# EasyEDA Pro project gdRelay.eprj

# Schematic Schematic1
Board Name: Rx; Create Date: 2024-09-17
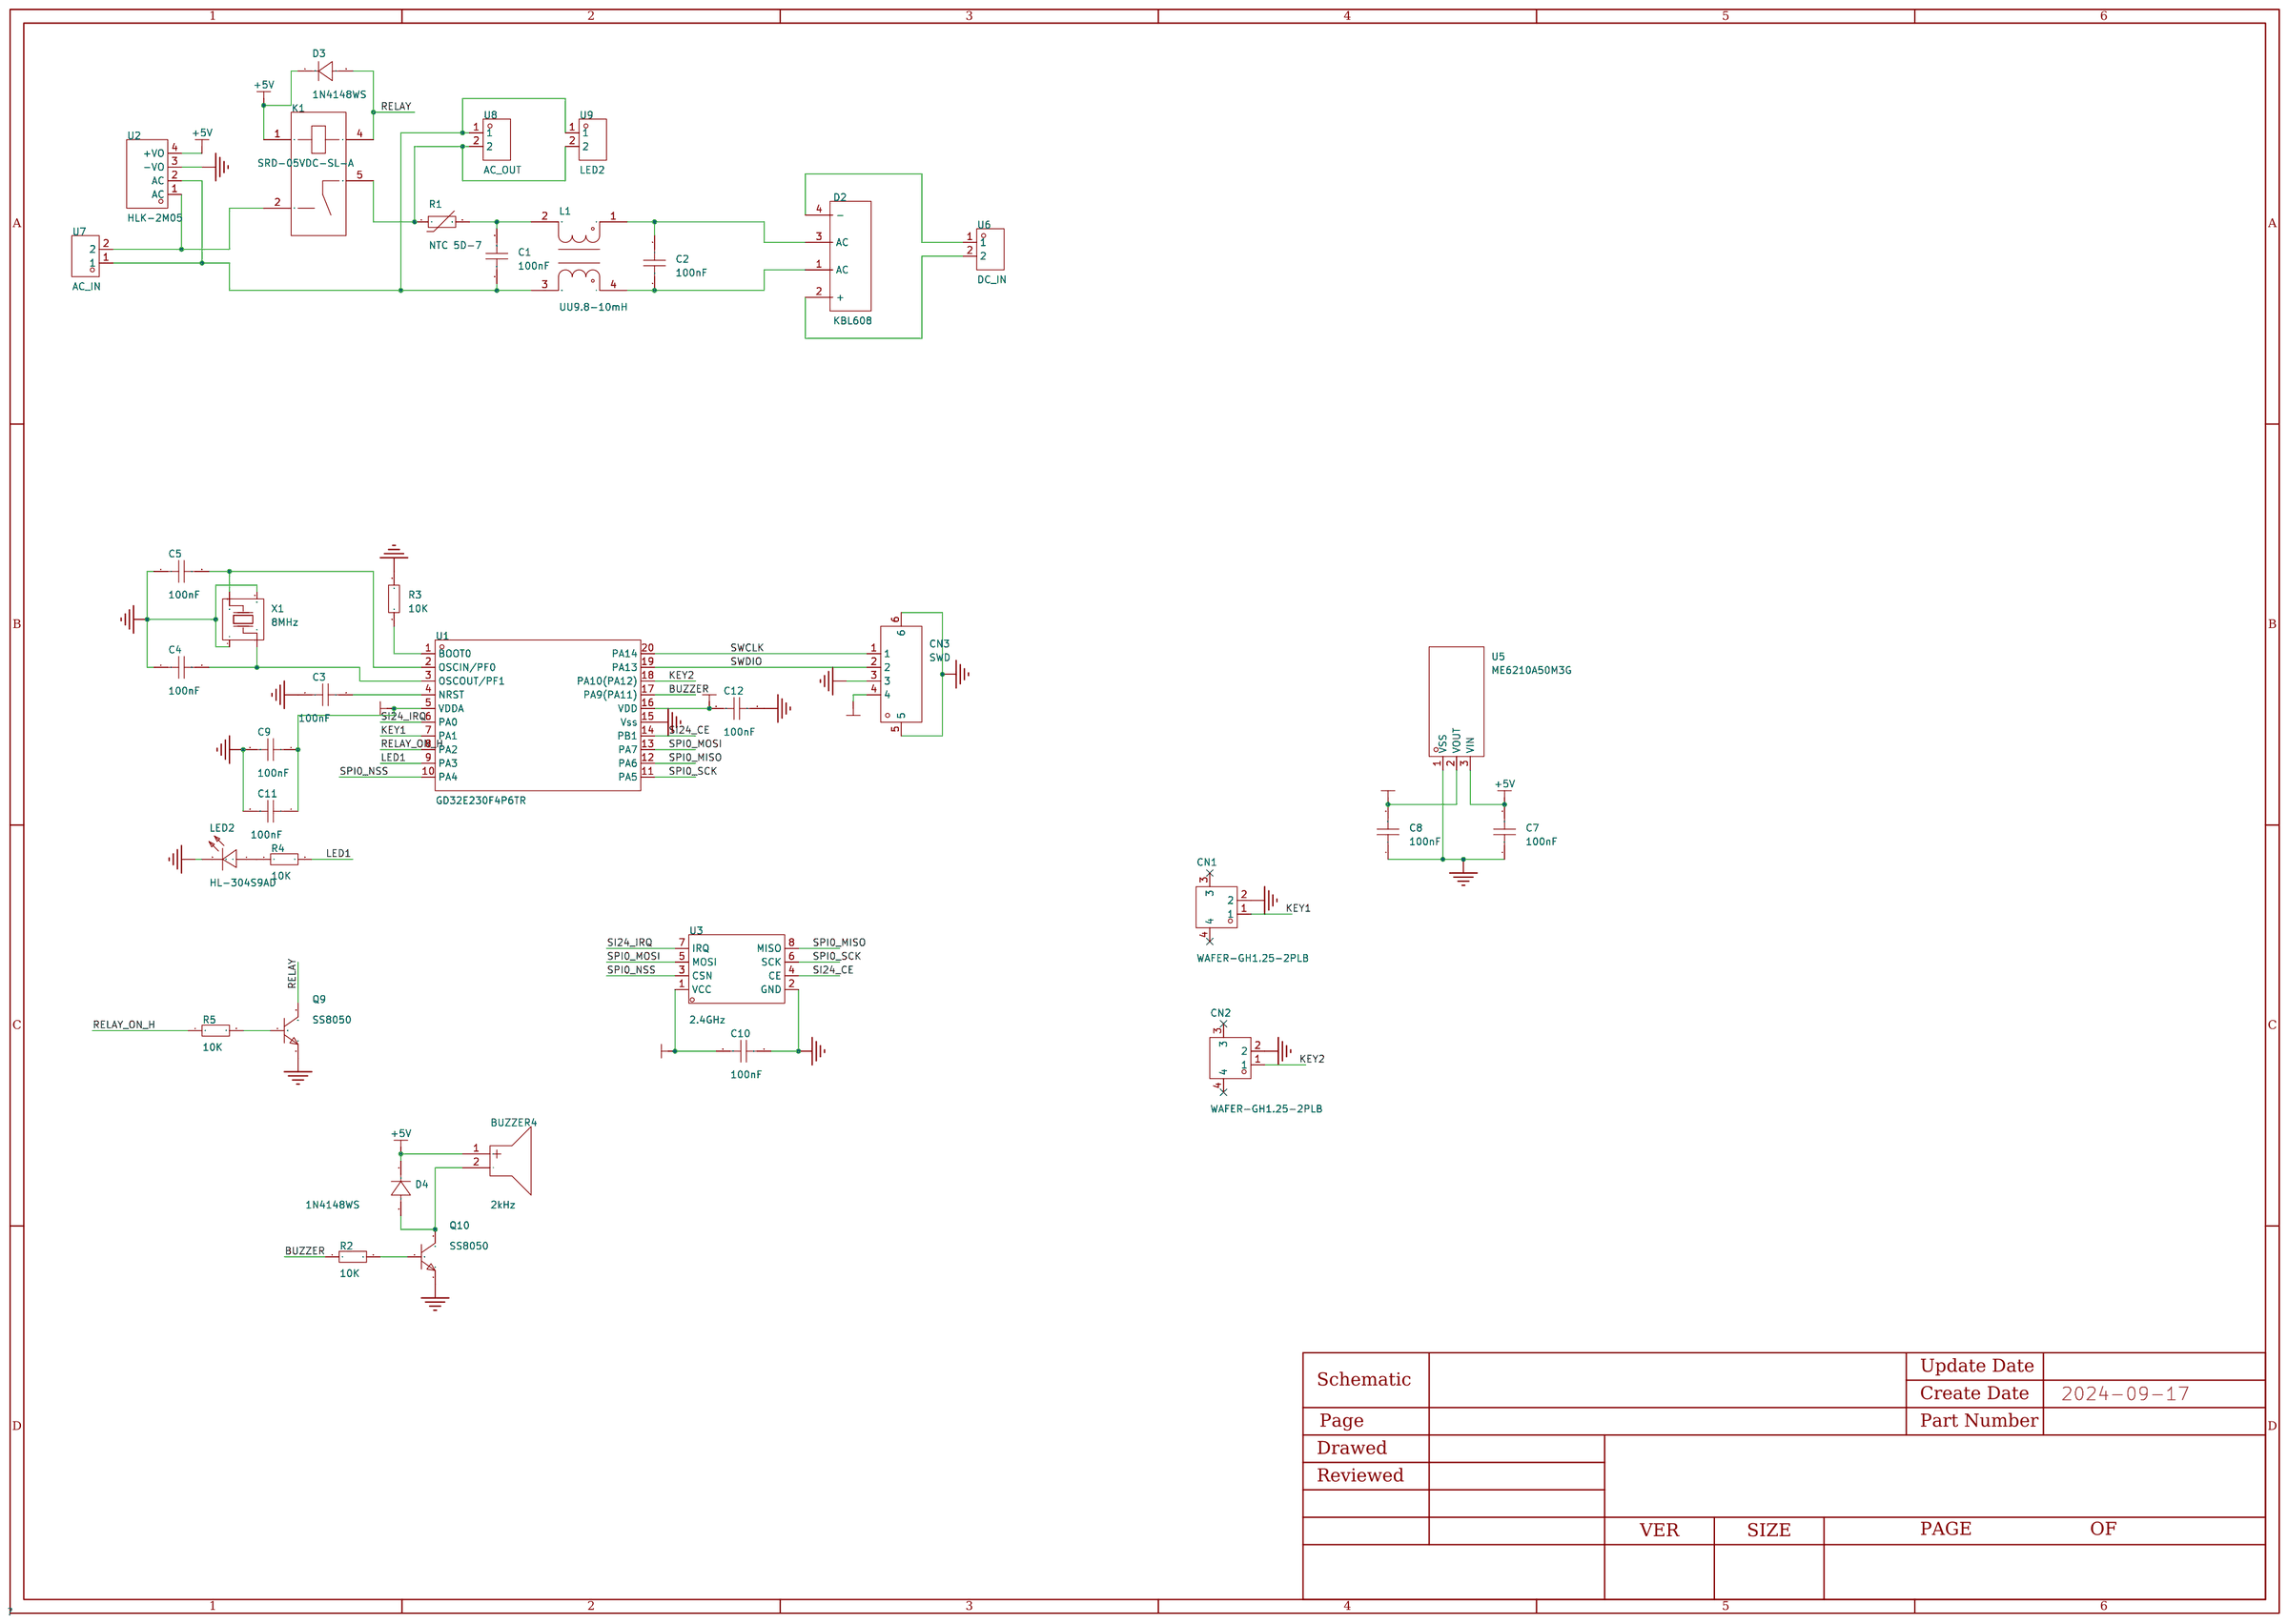
[diagram p0: schematic sheet]

## Parts
BUZZER4  2kHz  [BUZ-SMD_2P-L12.0-W12.0-L]
C1  100nF  [CAP-TH_L13.0-W6.0-P10.0-D0.6]
C2  100nF  [CAP-TH_L13.0-W6.0-P10.0-D0.6]
C3  100nF  [C0603]
C4  100nF  [C0603]
C5  100nF  [C0603]
C7  100nF  [C0603]
C8  100nF  [C0603]
C9  100nF  [C0603]
C10  100nF  [C0603]
C11  100nF  [C0603]
C12  100nF  [C0603]
CN1  WAFER-GH1.25-2PLB  [CONN-TH_2P-P1.25_XUNPU_WAFER-GH1.25-2PLB]
CN2  WAFER-GH1.25-2PLB  [CONN-TH_2P-P1.25_XUNPU_WAFER-GH1.25-2PLB]
CN3  SWD  [CONN-SMD_4P-P1.27_GH125-S04DCA-00]
D2  KBL608  [DIO-BG-TH_KBL608]
D3  1N4148WS  [SOD-323_L1.8-W1.3-LS2.5-RD]
D4  1N4148WS  [SOD-323_L1.8-W1.3-LS2.5-RD]
K1  SRD-05VDC-SL-A  [RELAY-TH_SRD-DCXXV-SL-A]
L1  UU9.8-10mH  [FILTER-TH_4P-L17.0-W12.0-P7.00-D0.6-S8.00]
LED2  HL-304S9AD  [LED-TH_BD3.0-P2.54-FD]
Q9  SS8050  [SOT-23-3_L2.9-W1.3-P1.90-LS2.4-BR]
Q10  SS8050  [SOT-23-3_L2.9-W1.3-P1.90-LS2.4-BR]
R1  NTC 5D-7  [RES-TH_L8.5-W5.5-P5.00-D0.6-S5.50]
R2  10K  [R0603]
R3  10K  [R0603]
R4  10K  [R0603]
R5  10K  [R0603]
U1  GD32E230F4P6TR  [TSSOP-20_L6.5-W4.4-P0.65-LS6.4-BL]
U2  HLK-2M05  [PWRM-TH_HLK-2M05]
U3  2.4GHz  [WIRELM-TH_NF-01-S]
U5  ME6210A50M3G  [SOT-23-3_L2.9-W1.6-P1.90-LS2.8-BR]
U6  DC_IN  [CONN-TH_VH3.96-3A2]
U7  AC_IN  [CONN-TH_VH3.96-3A2]
U8  AC_OUT  [CONN-TH_VH3.96-3A2]
U9  LED2  [CONN-TH_VH3.96-3A2]
X1  8MHz  [OSC-SMD_4P-L3.2-W2.5-BL]

## Library data of the parts
BUZZER4 = PKLCS1212E2000-R1: LCSC Part Name: 压电蜂鸣器 2kHz 12.0*12.0*3.0 mm; Supplier Part: C184513; Manufacturer: muRata(村田); JLCPCB Part Class: 扩展库; Datasheet: https://atta.szlcsc.com/upload/public/pdf/source/20200305/C492053_735FBBD713E87D0F645D81009B709975.pdf; Supplier: LCSC; Oscillator Circuit: 无源(外部驱动); Technology Type: 压电式; Operating Voltage: -12.5V~12.5V; Sound Pressure Level (SPL): 76dB@1.5V,10cm; Length: 12mm; Width: 12mm; Height: 3mm; Operating Temperature: -20℃~+70℃
C1 C2 = MKP62-275V104KP10: LCSC Part Name: 100nF ±10% 275V; Supplier Part: C2888214; Manufacturer: 东通电子; Supplier Footprint: 插件,P=10mm; JLCPCB Part Class: 扩展库; Datasheet: https://atta.szlcsc.com/upload/public/pdf/source/20210917/C2888214_A5EBC9FD7D7E3E6A075EFE493DE417E1.pdf; Supplier: LCSC; Tolerance: ±10%; Voltage(AC): 275V
C3-C5 C7-C12 = CAP_0603: Supplier Footprint: 0603
CN1 CN2 = WAFER-GH1.25-2PLB: LCSC Part Name: 1x2P 间距:1.25mm 立贴 系列:GH; Supplier Part: C3029368; Manufacturer: XUNPU(讯普); Supplier Footprint: SMD,P=1.25mm; JLCPCB Part Class: 扩展库; Datasheet: https://atta.szlcsc.com/upload/public/pdf/source/20220527/44F824AAC8C2B617205E15955FF9C23D.pdf; Supplier: LCSC; Pins Structure: 1x2P; Pitch: 1.25mm; Mounting Style: 立贴; Reference Series: GH; Number of Pins: 2P; Number of Rows: 1; Number of PINs Per Row: 2; Current Rating (Max): 1A; Operating Temperature Range: -25℃~+85℃
CN3 = GH125-S04DCA-00: 参考系列:-;间距:1.25mm;插针结构:1x4P;排数:1;每排PIN数:4;行距:-;公母:公型插针;安装方式:卧贴;额定电流:1A;工作温度范围:-25℃~+85℃;; LCSC Part Name: GH1.25卧式贴片 带扣; Supplier Part: C2886767; Manufacturer: JS(钜硕电子); Supplier Footprint: SMD,P=1.25mm; JLCPCB Part Class: Extended Part; Datasheet: https://atta.szlcsc.com/upload/public/pdf/source/20210818/CD11791E5ED3EDF45A7009E9C8A2BD4C.pdf; Supplier: LCSC; Pitch: 1.25mm; Pins Structure: 1x4P; Number of Rows: 1; Number of PINs Per Row: 4; Gender: 公型插针; Mounting Style: 卧贴; Current Rating (Max): 1A; Operating Temperature Range: -25℃~+85℃
D2 = KBL608_C3079: LCSC Part Name: 电压:800V 电流:6A; Supplier Part: C3079; Manufacturer: MDD(辰达半导体); Supplier Footprint: KBL; JLCPCB Part Class: 扩展库; Datasheet: https://atta.szlcsc.com/upload/public/pdf/source/20230823/BFC536A4B8673FA6F3DAD8CF9F959871.pdf; Supplier: LCSC; Forward Voltage (Vf@If): 1.1V@6A; Reverse Voltage (Vr): 800V; Rectified Current: 6A; Reverse Leakage Current (Ir): 10uA@800V; Peak Forward Surge Current: 200A; Operating Temperature: -55℃~+150℃@(Tj)
D3 D4 = 1N4148WS_C917117: LCSC Part Name: 电压:100V 电流:300mA; Supplier Part: C917117; Manufacturer: JSMSEMI(杰盛微); Supplier Footprint: SOD-323; JLCPCB Part Class: 扩展库; Datasheet: https://atta.szlcsc.com/upload/public/pdf/source/20230807/08D9F448A82EA88A23B325A669586A09.pdf; Supplier: LCSC; Diode Configuration: 独立式; Forward Voltage (Vf@If): 1.25V@150mA; Reverse Voltage (Vr): 100V; Average Rectified Current (Io): 300mA; Power Dissipation: 400mW; Reverse Leakage Current: 1uA@75V; Reverse Recovery Time (trr): 8ns; Operating Temperature: -55℃~+150℃@(Tj)
K1 = SRD-05VDC-SL-A_C688861: LCSC Part Name: 5V继电器 单刀单掷-常开; Supplier Part: C688861; Manufacturer: 松乐; Supplier Footprint: 插件,15.6x19.2mm; JLCPCB Part Class: 扩展库; Datasheet: https://atta.szlcsc.com/upload/public/pdf/source/20200305/C490149_C96E4098A3B1FFB377D5AD2E40B7C2A8.pdf; Supplier: LCSC; Coil Voltage: 5V; Contact Form: 一组常开:1A(单刀单掷-常开); Pin Number: 4; Maximum Switching Voltage: 250V@AC; Coil Rated Power: 360mW; Maximum Switching Current: 15A; Coil Type: 无极性-单线圈; Coil Resistance: 70Ω; Contact Resistance: 100mΩ; Operate Time: 10ms; Release Time: 10ms
L1 = UU9.8-10mH: LCSC Part Name: 两路 插件共模滤波器; Supplier Part: C148474; Manufacturer: FH(风华); Supplier Footprint: 插件; JLCPCB Part Class: 扩展库; Datasheet: https://atta.szlcsc.com/upload/public/pdf/source/20240328/5015935DB66968DB5A16B6B8180FA7CF.pdf; Supplier: LCSC; Number of Lines: 2; Withstanding Voltage: 1kV; Inductance @ Frequency: 10mH@1kHz; DC Resistance (DCR): 800mΩ
LED2 = HL-304S9AD: Supplier Part: C568936; Manufacturer: HONGLITRONIC(鸿利光电); Supplier Footprint: 插件,D=3mm; JLCPCB Part Class: 扩展库; Datasheet: https://atta.szlcsc.com/upload/public/pdf/source/20200630/C568936_361459151DDEDF72172B9683A2A9AC96.pdf; Supplier: LCSC; Lamp Holder Type: 3mm圆形灯头; Emitted Color: 红色; Forward Voltage (VF): 2.2V; Power Dissipation: 66mW; Forward Current: 20mA; Dominant Wavelength: 627nm~635nm; Lens Color: 雾状红透镜; Luminous Intensity: 460mcd; Viewing Angle: 40°; Operating Temperature: -30℃~+80℃
Q9 Q10 = SS8050_C7420370: LCSC Part Name: 耐压:25V 电流:1.5A NPN H档 200-350; Supplier Part: C7420370; Manufacturer: 宏迦橙; Supplier Footprint: SOT-23; JLCPCB Part Class: 扩展库; Datasheet: https://atta.szlcsc.com/upload/public/pdf/source/20231222/9C4050A7669EB24B3ACD0418218817FD.pdf; Supplier: LCSC; Transistor Type: NPN; Collector Current (Ic): 1.5A; Collector-Emitter Breakdown Voltage (Vceo): 25V; Power Dissipation (Pd): 300mW; DC Current Gain (hFE@Ic,Vce): 120@100mA,1.0V; Transition Frequency (fT): 100MHz; Collector Cut-Off Current (Icbo): 100nA; Collector-Emitter Saturation Voltage (VCE(sat)@Ic,Ib): 500mV@800mA,80mA; Operating Temperature: -55℃~+150℃
R1 = NTC 5D-7: LCSC Part Name: 5Ω; Supplier Part: C5385; Manufacturer: RUILON(瑞隆源); Supplier Footprint: 插件,P=5mm; JLCPCB Part Class: 扩展库; Datasheet: https://atta.szlcsc.com/upload/public/pdf/source/20180410/C207392_007A1CB20DB6E487C695D7783FF0F5F9.pdf; Supplier: LCSC; Resistance @ 25℃: 5Ω; Steady State Current (Max): 2A; Operating Temperature: -55℃~+200℃
R2-R5 = Res_0603: Supplier Footprint: 0603
U1 = GD32E230F4P6TR: Supplier Part: C2842295; Manufacturer: GigaDevice(兆易创新); Supplier Footprint: TSSOP-20; JLCPCB Part Class: 扩展库; Datasheet: https://atta.szlcsc.com/upload/public/pdf/source/20240402/A7F4CC4CD3D7DC7CD15A7FB0DE571B27.pdf; Supplier: LCSC; Program Storage Size: 16KB; RAM Size: 4KB; GPIO Ports Number: 15; Operating Voltage Range: 1.8V~3.6V; CPU Maximum Speed: 72MHz; Program Memory Type: FLASH; Operating Temperature Range: -40℃~+85℃; ADC (Bit): 12bit; PWM (Bit): 16bit; 16Bit Timer: 5; UART/USART: 1; I2C: 1; SPI: 1; Internal Comparator: 有; Peripheral/Function: 温度传感器；DMA；看门狗；LIN总线协议；PWM；IrDA；RTC实时时钟; Watchdog: 有; Real-Time Clock: 有; Infrared Data Association: 有; Direct Memory Access: 有; Internal Oscillator: 有
U2 = HLK-2M05: Supplier Part: C209909; Manufacturer: HI-LINK(海凌科); Supplier Footprint: 插件; JLCPCB Part Class: 扩展库; Datasheet: https://atta.szlcsc.com/upload/public/pdf/source/20211130/BB6CF3554B3927EB762928BD287CEFEE.pdf; Supplier: LCSC
U3 = NF-01-S: LCSC Part Name: 2.4G无线模块，新版的NF-01-S; Supplier Part: C135576; Manufacturer: Ai-Thinker(安信可); Supplier Footprint: DIP-8; JLCPCB Part Class: 扩展库; Datasheet: https://atta.szlcsc.com/upload/public/pdf/source/20180404/C135576_0550A89EE6EE32369D734FB4B4EB7736.pdf; Supplier: LCSC; Model: 发射; Modulation System: FSK；GFSK; Output Power  (Max): 7dBm; Support Interface: SPI; Operating Voltage: 1.9V~3.6V; Antenna Type: 板载PCB天线; Receive  Current: 15mA; Send  Current: 25mA; Sensitivity: -96dBm; Operating Temperature: -20℃~+85℃
U5 = ME6210A50M3G: LCSC Part Name: 输入18V 输出5V 500mA; Supplier Part: C236679; Manufacturer: MICRONE(南京微盟); Supplier Footprint: SOT-23; JLCPCB Part Class: 扩展库; Datasheet: https://atta.szlcsc.com/upload/public/pdf/source/20190709/C403652_164B03470289BC6E2EF0FCF22B47472A.pdf; Supplier: LCSC; Output Type: 固定; Maximum Input Voltage: 18V; Output Voltage: 5V; MAX Output Current: 500mA; Dropout Voltage: 220mV@(200mA); Output Polarity: 正极; Number of Outputs: 1
U6-U9 = VH3.96-3P(2P) ZZ: LCSC Part Name: 1x3P 间距:3.96mm 直插 系列:VH; Supplier Part: C5884431; Manufacturer: SHOU HAN(首韩); Supplier Footprint: 插件,P=3.96mm; JLCPCB Part Class: 扩展库; Datasheet: https://atta.szlcsc.com/upload/public/pdf/source/20230506/E8E7E8C8F22F3A8211E3BB95A79C703A.pdf; Supplier: LCSC; Pins Structure: 1x3P; Pitch: 3.96mm; Mounting Style: 直插; Reference Series: VH; Number of Pins: 3P; Number of Rows: 1; Number of PINs Per Row: 3; Row Spacing: 3.96mm; Current Rating (Max): 7A; Contact Material: 黄铜; Contact Plating: 锡; Operating Temperature Range: -25℃~+85℃
X1 = TAXM8M4RDBCCT2T: LCSC Part Name: 8MHz ±10ppm 10pF; Supplier Part: C400090; Manufacturer: YJX(雅晶鑫); Supplier Footprint: SMD3225-4P; JLCPCB Part Class: 扩展库; Datasheet: https://atta.szlcsc.com/upload/public/pdf/source/20190626/C400090_CF95B89E745AFE4EF2E392EF8AC009D6.pdf; Supplier: LCSC; Crystal Type: 贴片晶振; Normal temperature Frequency Tolerance: ±10ppm; External load capacitor: 10pF; Frequency Stability(Full temperature range): ±15ppm; Equivalent Series Resistance (ESR): 250Ω; Operating Temperature: -40℃~+85℃

## Nets
+3.3V: C8.2 C9.1 C10.2 C11.1 C12.2 CN3.4 U1.5(VDDA) U1.16(VDD) U3.1(VCC) U5.2(VOUT)
+5V: BUZZER4.1(+) C7.2 D3.1(C) D4.1(C) K1.1 U2.4(+VO) U5.3(VIN)
GND: C3.1 C4.1 C5.1 C7.1 C8.1 C9.2 C10.1 C11.2 C12.1 CN1.2 CN2.2 CN3.3 CN3.5 CN3.6 LED2.2(C) Q9.2(E) Q10.2(E) R3.2 U1.15(Vss) U2.3(-VO) U3.2(GND) U5.1(VSS) X1.2 X1.4
BUZZER: R2.1 U1.17(PA9(PA11))
KEY1: CN1.1 U1.7(PA1)
KEY2: CN2.1 U1.18(PA10(PA12))
LED1: R4.2 U1.9(PA3)
RELAY: D3.2(A) K1.4 Q9.3(C)
RELAY_ON_H: R5.1 U1.8(PA2)
SI24_CE: U1.14(PB1) U3.4(CE)
SI24_IRQ: U1.6(PA0) U3.7(IRQ)
SPI0_MISO: U1.12(PA6) U3.8(MISO)
SPI0_MOSI: U1.13(PA7) U3.5(MOSI)
SPI0_NSS: U1.10(PA4) U3.3(CSN)
SPI0_SCK: U1.11(PA5) U3.6(SCK)
SWCLK: CN3.1 U1.20(PA14)
SWDIO: CN3.2 U1.19(PA13)
$1N1219: C1.2 L1.2 R1.2
$1N1562: C2.1 D2.1(AC) L1.4
$1N1568: C2.2 D2.3(AC) L1.1
$1N1587: C1.1 L1.3 U2.2(AC) U7.1 U8.1 U9.1
$1N1625: K1.5 R1.1 U8.2 U9.2
$1N1813: D2.2(+) U6.2
$1N1820: D2.4(-) U6.1
$1N2210: C3.2 U1.4(NRST)
$1N2387: C4.2 U1.3(OSCOUT/PF1) X1.1
$1N2393: C5.2 U1.2(OSCIN/PF0) X1.3
$1N2535: R3.1 U1.1(BOOT0)
$1N3342: Q9.1(B) R5.2
$1N5543: LED2.1(A) R4.1
$1N5747: Q10.1(B) R2.2
$1N6773: BUZZER4.2(-) D4.2(A) Q10.3(C)
$1N7266: K1.2 U2.1(AC) U7.2

Not connected (* = marked no-connect by the designer): CN1 3* 4*; CN2 3* 4*

# Schematic Schematic2
Board Name: Tx; Create Date: 2024-09-17
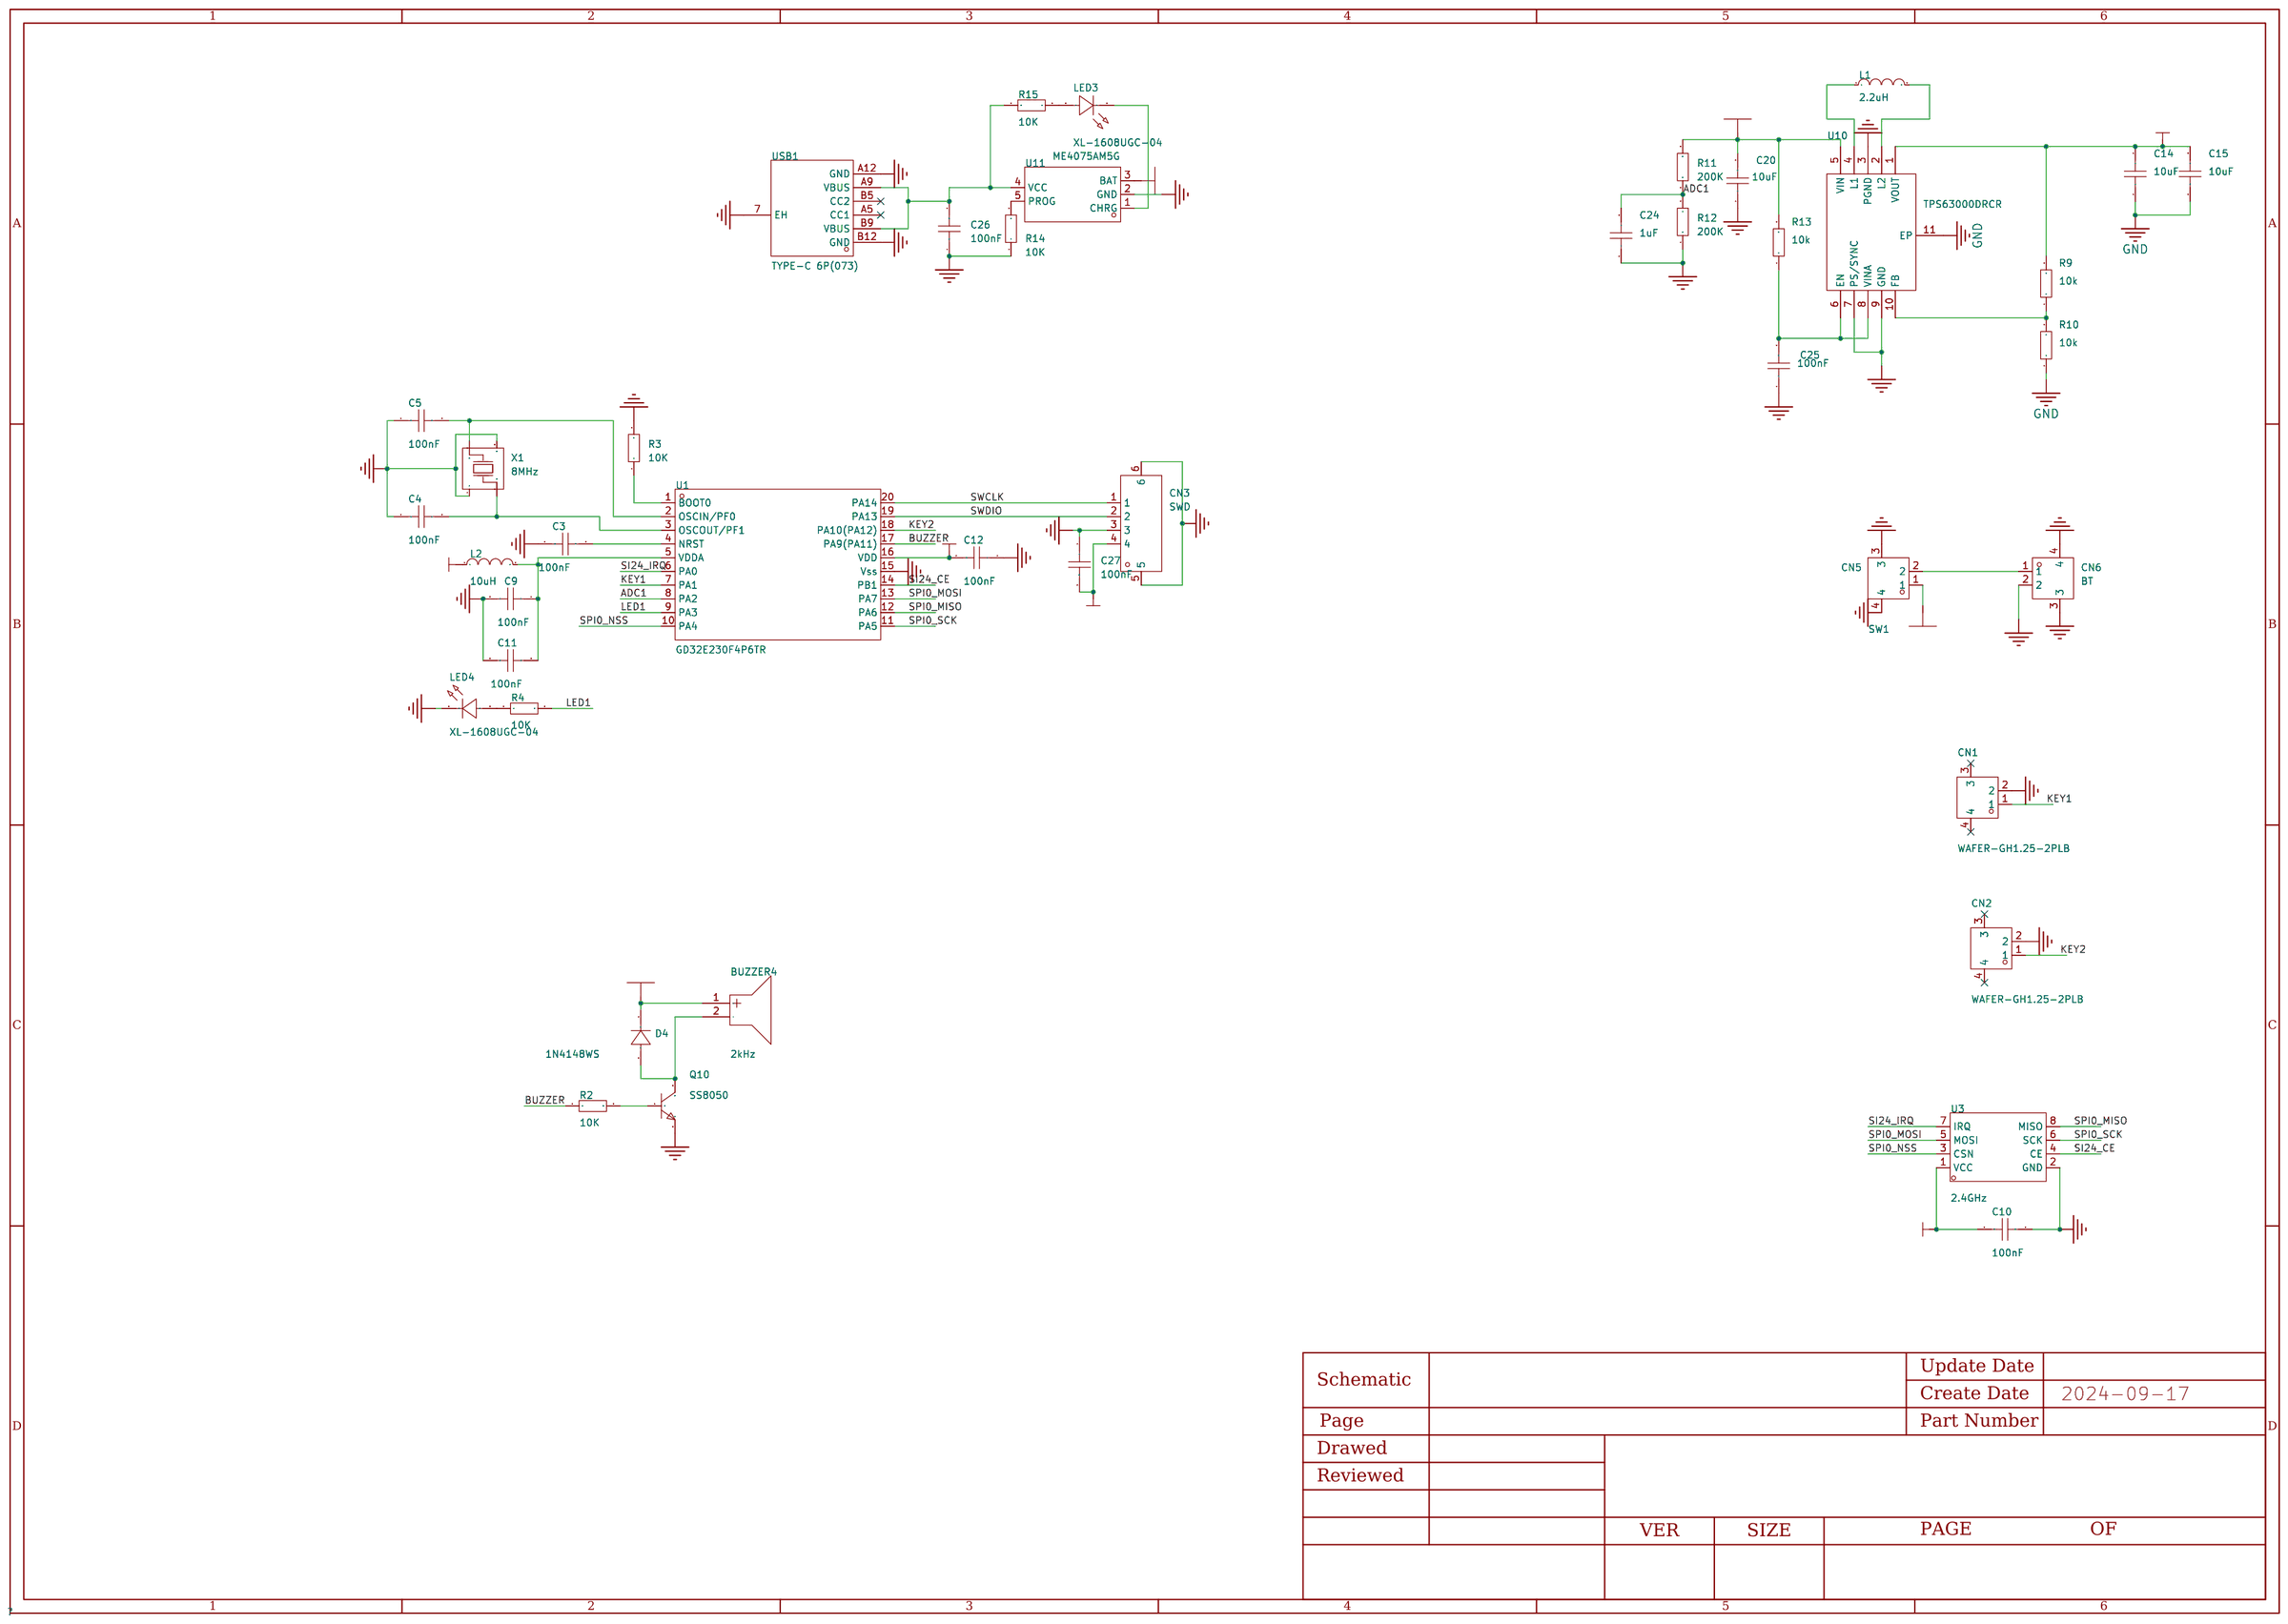
[diagram p1: schematic sheet]

## Parts
BUZZER4  2kHz  [BUZ-SMD_2P-L12.0-W12.0-L]
C3  100nF  [C0603]
C4  100nF  [C0603]
C5  100nF  [C0603]
C9  100nF  [C0603]
C10  100nF  [C0603]
C11  100nF  [C0603]
C12  100nF  [C0603]
C14  10uF  [C0603]
C15  10uF  [C0603]
C20  10uF  [C0603]
C24  1uF  [C0603]
C25  100nF  [C0603]
C26  100nF  [C0603]
C27  100nF  [C0603]
CN1  WAFER-GH1.25-2PLB  [CONN-TH_2P-P1.25_XUNPU_WAFER-GH1.25-2PLB]
CN2  WAFER-GH1.25-2PLB  [CONN-TH_2P-P1.25_XUNPU_WAFER-GH1.25-2PLB]
CN3  SWD  [CONN-SMD_4P-P1.27_GH125-S04DCA-00]
CN5  SW1  [CONN-TH_2P-P1.25_XUNPU_WAFER-GH1.25-2PLB]
CN6  BT  [CONN-TH_2P-P1.25_XUNPU_WAFER-GH1.25-2PLB]
D4  1N4148WS  [SOD-323_L1.8-W1.3-LS2.5-RD]
L1  2.2uH  [IND-SMD_L4.0-W4.0_FNR40XXS]
L2  10uH  [L0603]
LED3  XL-1608UGC-04  [LED0603-RD_GREEN]
LED4  XL-1608UGC-04  [LED0603-RD_GREEN]
Q10  SS8050  [SOT-23-3_L2.9-W1.3-P1.90-LS2.4-BR]
R2  10K  [R0603]
R3  10K  [R0603]
R4  10K  [R0603]
R9  10k  [R0603]
R10  10k  [R0603]
R11  200K  [R0603]
R12  200K  [R0603]
R13  10k  [R0603]
R14  10K  [R0603]
R15  10K  [R0603]
U1  GD32E230F4P6TR  [TSSOP-20_L6.5-W4.4-P0.65-LS6.4-BL]
U3  2.4GHz  [WIRELM-TH_NF-01-S]
U10  TPS63000DRCR  [SON-10_L3.1-W3.1-P0.50-TL-EP]
U11  ME4075AM5G  [SOT-23-5_L2.9-W1.6-P0.95-LS2.8-BL]
USB1  TYPE-C 6P(073)  [TYPE-C-SMD_TYPE-C-6P_5]
X1  8MHz  [OSC-SMD_4P-L3.2-W2.5-BL]

## Library data of the parts
BUZZER4 = PKLCS1212E2000-R1: LCSC Part Name: 压电蜂鸣器 2kHz 12.0*12.0*3.0 mm; Supplier Part: C184513; Manufacturer: muRata(村田); JLCPCB Part Class: 扩展库; Datasheet: https://atta.szlcsc.com/upload/public/pdf/source/20200305/C492053_735FBBD713E87D0F645D81009B709975.pdf; Supplier: LCSC; Oscillator Circuit: 无源(外部驱动); Technology Type: 压电式; Operating Voltage: -12.5V~12.5V; Sound Pressure Level (SPL): 76dB@1.5V,10cm; Length: 12mm; Width: 12mm; Height: 3mm; Operating Temperature: -20℃~+70℃
C3-C5 C9-C12 C26 C27 = CAP_0603: Supplier Footprint: 0603
C14 C15 C20 C24 C25 = CC0603KRX7R9BB104: 容值:100nF;精度:±10%;额定电压:50V;温度系数:X7R;; LCSC Part Name: 100nF ±10% 50V; Supplier Part: C14663; Manufacturer: YAGEO(国巨); Supplier Footprint: 0603; JLCPCB Part Class: Basic Part; Datasheet: https://atta.szlcsc.com/upload/public/pdf/source/20170116/1484561234239.pdf; Supplier: LCSC; Tolerance: ±10%; Voltage Rated: 50V; Temperature Coefficient: X7R
CN1 CN2 CN5 CN6 = WAFER-GH1.25-2PLB: LCSC Part Name: 1x2P 间距:1.25mm 立贴 系列:GH; Supplier Part: C3029368; Manufacturer: XUNPU(讯普); Supplier Footprint: SMD,P=1.25mm; JLCPCB Part Class: 扩展库; Datasheet: https://atta.szlcsc.com/upload/public/pdf/source/20220527/44F824AAC8C2B617205E15955FF9C23D.pdf; Supplier: LCSC; Pins Structure: 1x2P; Pitch: 1.25mm; Mounting Style: 立贴; Reference Series: GH; Number of Pins: 2P; Number of Rows: 1; Number of PINs Per Row: 2; Current Rating (Max): 1A; Operating Temperature Range: -25℃~+85℃
CN3 = GH125-S04DCA-00: 参考系列:-;间距:1.25mm;插针结构:1x4P;排数:1;每排PIN数:4;行距:-;公母:公型插针;安装方式:卧贴;额定电流:1A;工作温度范围:-25℃~+85℃;; LCSC Part Name: GH1.25卧式贴片 带扣; Supplier Part: C2886767; Manufacturer: JS(钜硕电子); Supplier Footprint: SMD,P=1.25mm; JLCPCB Part Class: Extended Part; Datasheet: https://atta.szlcsc.com/upload/public/pdf/source/20210818/CD11791E5ED3EDF45A7009E9C8A2BD4C.pdf; Supplier: LCSC; Pitch: 1.25mm; Pins Structure: 1x4P; Number of Rows: 1; Number of PINs Per Row: 4; Gender: 公型插针; Mounting Style: 卧贴; Current Rating (Max): 1A; Operating Temperature Range: -25℃~+85℃
D4 = 1N4148WS_C917117: LCSC Part Name: 电压:100V 电流:300mA; Supplier Part: C917117; Manufacturer: JSMSEMI(杰盛微); Supplier Footprint: SOD-323; JLCPCB Part Class: 扩展库; Datasheet: https://atta.szlcsc.com/upload/public/pdf/source/20230807/08D9F448A82EA88A23B325A669586A09.pdf; Supplier: LCSC; Diode Configuration: 独立式; Forward Voltage (Vf@If): 1.25V@150mA; Reverse Voltage (Vr): 100V; Average Rectified Current (Io): 300mA; Power Dissipation: 400mW; Reverse Leakage Current: 1uA@75V; Reverse Recovery Time (trr): 8ns; Operating Temperature: -55℃~+150℃@(Tj)
L1 = FNR4030S1R5MT: 电感值:1.5uH;精度:±20%;额定电流:3.34A;直流电阻(DCR):26m;; LCSC Part Name: 1.5uH ±20% 3.34A 26m; Supplier Part: C167867; Manufacturer: cjiang(长江微电); Supplier Footprint: SMD; JLCPCB Part Class: Extended Part; Datasheet: https://atta.szlcsc.com/upload/public/pdf/source/20190327/C167867_08768CA7262D1F95412648A118D7A069.pdf; Supplier: LCSC; Tolerance: ±20%; Rated Current: 3.34A; DC Resistance (DCR): 26m
L2 = LQM18FN100M00D: LCSC Part Name: 10uH ±20% 50mA; Supplier Part: C86083; Manufacturer: muRata(村田); Supplier Footprint: 0603; JLCPCB Part Class: 扩展库; Datasheet: https://atta.szlcsc.com/upload/public/pdf/source/20181211/C324471_E5AB673E56FAD8B75EB4C57DC23E4148.pdf; Supplier: LCSC; Tolerance: ±20%; Rated Current: 50mA; Saturation Current (Isat): 50mA; DC Resistance (DCR): 1.17Ω; Frequency - Self Resonant: 30MHz
LED3 LED4 = XL-1608UGC-04: Supplier Part: C965804; Manufacturer: XINGLIGHT(成兴光); Supplier Footprint: 0603; JLCPCB Part Class: 扩展库; Datasheet: https://atta.szlcsc.com/upload/public/pdf/source/20221102/520D6E465E5CFD1609C8A4DBC80D4018.pdf; Supplier: LCSC; Emitted Color: 翠绿色; Power Dissipation: 80mW; Forward Current: 25mA; Dominant Wavelength: 516nm~525nm; Peak Wavelength: 534nm; Diode Configuration: 独立二极管; Lens Color: 无色透明透镜; Viewing Angle: 120°; Mounting Sytle: 正贴; Operating Temperature: -30℃~+85℃
Q10 = SS8050_C7420370: LCSC Part Name: 耐压:25V 电流:1.5A NPN H档 200-350; Supplier Part: C7420370; Manufacturer: 宏迦橙; Supplier Footprint: SOT-23; JLCPCB Part Class: 扩展库; Datasheet: https://atta.szlcsc.com/upload/public/pdf/source/20231222/9C4050A7669EB24B3ACD0418218817FD.pdf; Supplier: LCSC; Transistor Type: NPN; Collector Current (Ic): 1.5A; Collector-Emitter Breakdown Voltage (Vceo): 25V; Power Dissipation (Pd): 300mW; DC Current Gain (hFE@Ic,Vce): 120@100mA,1.0V; Transition Frequency (fT): 100MHz; Collector Cut-Off Current (Icbo): 100nA; Collector-Emitter Saturation Voltage (VCE(sat)@Ic,Ib): 500mV@800mA,80mA; Operating Temperature: -55℃~+150℃
R2-R4 R11 R12 R14 R15 = Res_0603: Supplier Footprint: 0603
R9 R10 R13 = TR0603B10K0P0525Z: 电阻类型:薄膜电阻;阻值:10k;精度:±0.1%;功率:100mW;温度系数:±25ppm/;最大工作电压:75V;工作温度范围:-55~+155;; LCSC Part Name: 10k ±0.1% 100mW; Supplier Part: C188363; Manufacturer: EVER OHMS(天二科技); Supplier Footprint: 0603; JLCPCB Part Class: Extended Part; Datasheet: https://atta.szlcsc.com/upload/public/pdf/source/20190415/C188363_433BF05B6FB8F7A0F5F35A3E4390C55A.pdf; Supplier: LCSC; Type: 薄膜电阻; Tolerance: ±0.1%; Power(Watts): 100mW; Temperature Coefficient: ±25ppm/; Overload Voltage (Max): 75V; Operating Temperature Range: -55~+155
U1 = GD32E230F4P6TR: Supplier Part: C2842295; Manufacturer: GigaDevice(兆易创新); Supplier Footprint: TSSOP-20; JLCPCB Part Class: 扩展库; Datasheet: https://atta.szlcsc.com/upload/public/pdf/source/20240402/A7F4CC4CD3D7DC7CD15A7FB0DE571B27.pdf; Supplier: LCSC; Program Storage Size: 16KB; RAM Size: 4KB; GPIO Ports Number: 15; Operating Voltage Range: 1.8V~3.6V; CPU Maximum Speed: 72MHz; Program Memory Type: FLASH; Operating Temperature Range: -40℃~+85℃; ADC (Bit): 12bit; PWM (Bit): 16bit; 16Bit Timer: 5; UART/USART: 1; I2C: 1; SPI: 1; Internal Comparator: 有; Peripheral/Function: 温度传感器；DMA；看门狗；LIN总线协议；PWM；IrDA；RTC实时时钟; Watchdog: 有; Real-Time Clock: 有; Infrared Data Association: 有; Direct Memory Access: 有; Internal Oscillator: 有
U3 = NF-01-S: LCSC Part Name: 2.4G无线模块，新版的NF-01-S; Supplier Part: C135576; Manufacturer: Ai-Thinker(安信可); Supplier Footprint: DIP-8; JLCPCB Part Class: 扩展库; Datasheet: https://atta.szlcsc.com/upload/public/pdf/source/20180404/C135576_0550A89EE6EE32369D734FB4B4EB7736.pdf; Supplier: LCSC; Model: 发射; Modulation System: FSK；GFSK; Output Power  (Max): 7dBm; Support Interface: SPI; Operating Voltage: 1.9V~3.6V; Antenna Type: 板载PCB天线; Receive  Current: 15mA; Send  Current: 25mA; Sensitivity: -96dBm; Operating Temperature: -20℃~+85℃
U10 = TPS63000DRCR: Supplier Part: C24966; Manufacturer: TI(德州仪器); Supplier Footprint: SON-10-EP(3.1x3.1); JLCPCB Part Class: 扩展库; Datasheet: https://www.ti.com/cn/lit/gpn/tps63000; Supplier: LCSC; Function: 升降压型; Output Type: 可调; Input Voltage: 1.8V~5.5V; Output Voltage: 1.2V~5.5V; Output Current (Max): 1.6A; Switching Frequency: 1.5MHz; Operating Temperature: -40℃~+85℃@(TA); Synchronous Rectification: 是; Number of Outputs: 1; Topology: 降压-升压式; Switch tube (built-in/external): 内置
U11 = ME4075AM5G: LCSC Part Name: 单节磷酸铁锂电池充电芯片; Supplier Part: C558564; Manufacturer: MICRONE(南京微盟); Supplier Footprint: SOT-23-5; JLCPCB Part Class: 扩展库; Datasheet: https://atta.szlcsc.com/upload/public/pdf/source/20200525/C558564_88164DE9DE160E2D6FBDFD2D9E6A2859.pdf; Supplier: LCSC
USB1 = TYPE-C 6P(073): LCSC Part Name: Type-C 母 卧贴; Supplier Part: C668623; Manufacturer: SHOU HAN(首韩); Supplier Footprint: SMD; JLCPCB Part Class: 扩展库; Datasheet: https://atta.szlcsc.com/upload/public/pdf/source/20200618/C668623_A4B260DED7AC1949BAC6AE39E9F4CD80.pdf; Supplier: LCSC; Connector Type: Type-C; Standard: USB 3.1; Gender: 母; Mounting Style: 卧贴; Number of Contacts: 6P; Number of Ports: 1; Current Rating - Power (Max): 3A; Operating Temperature Range: -25℃~+85℃; Rated Voltage (Max): 5V; Connect-Disconnect Life: 1万次; Core Colour: 黑色
X1 = TAXM8M4RDBCCT2T: LCSC Part Name: 8MHz ±10ppm 10pF; Supplier Part: C400090; Manufacturer: YJX(雅晶鑫); Supplier Footprint: SMD3225-4P; JLCPCB Part Class: 扩展库; Datasheet: https://atta.szlcsc.com/upload/public/pdf/source/20190626/C400090_CF95B89E745AFE4EF2E392EF8AC009D6.pdf; Supplier: LCSC; Crystal Type: 贴片晶振; Normal temperature Frequency Tolerance: ±10ppm; External load capacitor: 10pF; Frequency Stability(Full temperature range): ±15ppm; Equivalent Series Resistance (ESR): 250Ω; Operating Temperature: -40℃~+85℃

## Nets
+3.3V: C10.2 C12.2 C14.2 C15.2 C27.2 CN3.4 L2.1 R9.2 U1.16(VDD) U3.1(VCC) U10.1(VOUT)
GND: C3.1 C4.1 C5.1 C9.2 C10.1 C11.2 C12.1 C14.1 C15.1 C20.1 C24.1 C25.1 C26.1 C27.1 CN1.2 CN2.2 CN3.3 CN3.5 CN3.6 CN5.3 CN5.4 CN6.2 CN6.3 CN6.4 LED4.1(K) Q10.2(E) R3.2 R10.1 R12.1 R14.1 U1.15(Vss) U3.2(GND) U10.3(PGND) U10.7(PS/SYNC) U10.9(GND) U10.11(EP) U11.2(GND) USB1.7(EH) USB1.A12(GND) USB1.B12(GND) X1.2 X1.4
ADC1: C24.2 R11.1 R12.2 U1.8(PA2)
BT+: BUZZER4.1(+) C20.2 CN5.1 D4.1(C) R11.2 R13.2 U10.5(VIN) U11.3(BAT)
BUZZER: R2.1 U1.17(PA9(PA11))
KEY1: CN1.1 U1.7(PA1)
KEY2: CN2.1 U1.18(PA10(PA12))
LED1: R4.2 U1.9(PA3)
SI24_CE: U1.14(PB1) U3.4(CE)
SI24_IRQ: U1.6(PA0) U3.7(IRQ)
SPI0_MISO: U1.12(PA6) U3.8(MISO)
SPI0_MOSI: U1.13(PA7) U3.5(MOSI)
SPI0_NSS: U1.10(PA4) U3.3(CSN)
SPI0_SCK: U1.11(PA5) U3.6(SCK)
SWCLK: CN3.1 U1.20(PA14)
SWDIO: CN3.2 U1.19(PA13)
$1N1260: C9.1 C11.1 L2.2 U1.5(VDDA)
$1N1281: Q10.1(B) R2.2
$1N1282: BUZZER4.2(-) D4.2(A) Q10.3(C)
$1N1323: C5.2 U1.2(OSCIN/PF0) X1.3
$1N1324: C4.2 U1.3(OSCOUT/PF1) X1.1
$1N1340: C3.2 U1.4(NRST)
$1N1345: R3.1 U1.1(BOOT0)
$1N2047: L1.1 U10.4(L1)
$1N2048: L1.2 U10.2(L2)
$1N2057: R9.1 R10.2 U10.10(FB)
$1N2391: CN5.2 CN6.1
$1N2971: C25.2 R13.1 U10.6(EN) U10.8(VINA)
$1N3227: C26.2 R15.2 U11.4(VCC) USB1.A9(VBUS) USB1.B9(VBUS)
$1N4478: R14.2 U11.5(PROG)
$1N4641: LED3.2(A) R15.1
$1N4706: LED3.1(K) U11.1(CHRG)
$1N6003: LED4.2(A) R4.1

Not connected (* = marked no-connect by the designer): CN1 3* 4*; CN2 3* 4*; USB1 A5(CC1)* B5(CC2)*

# Board PCB1
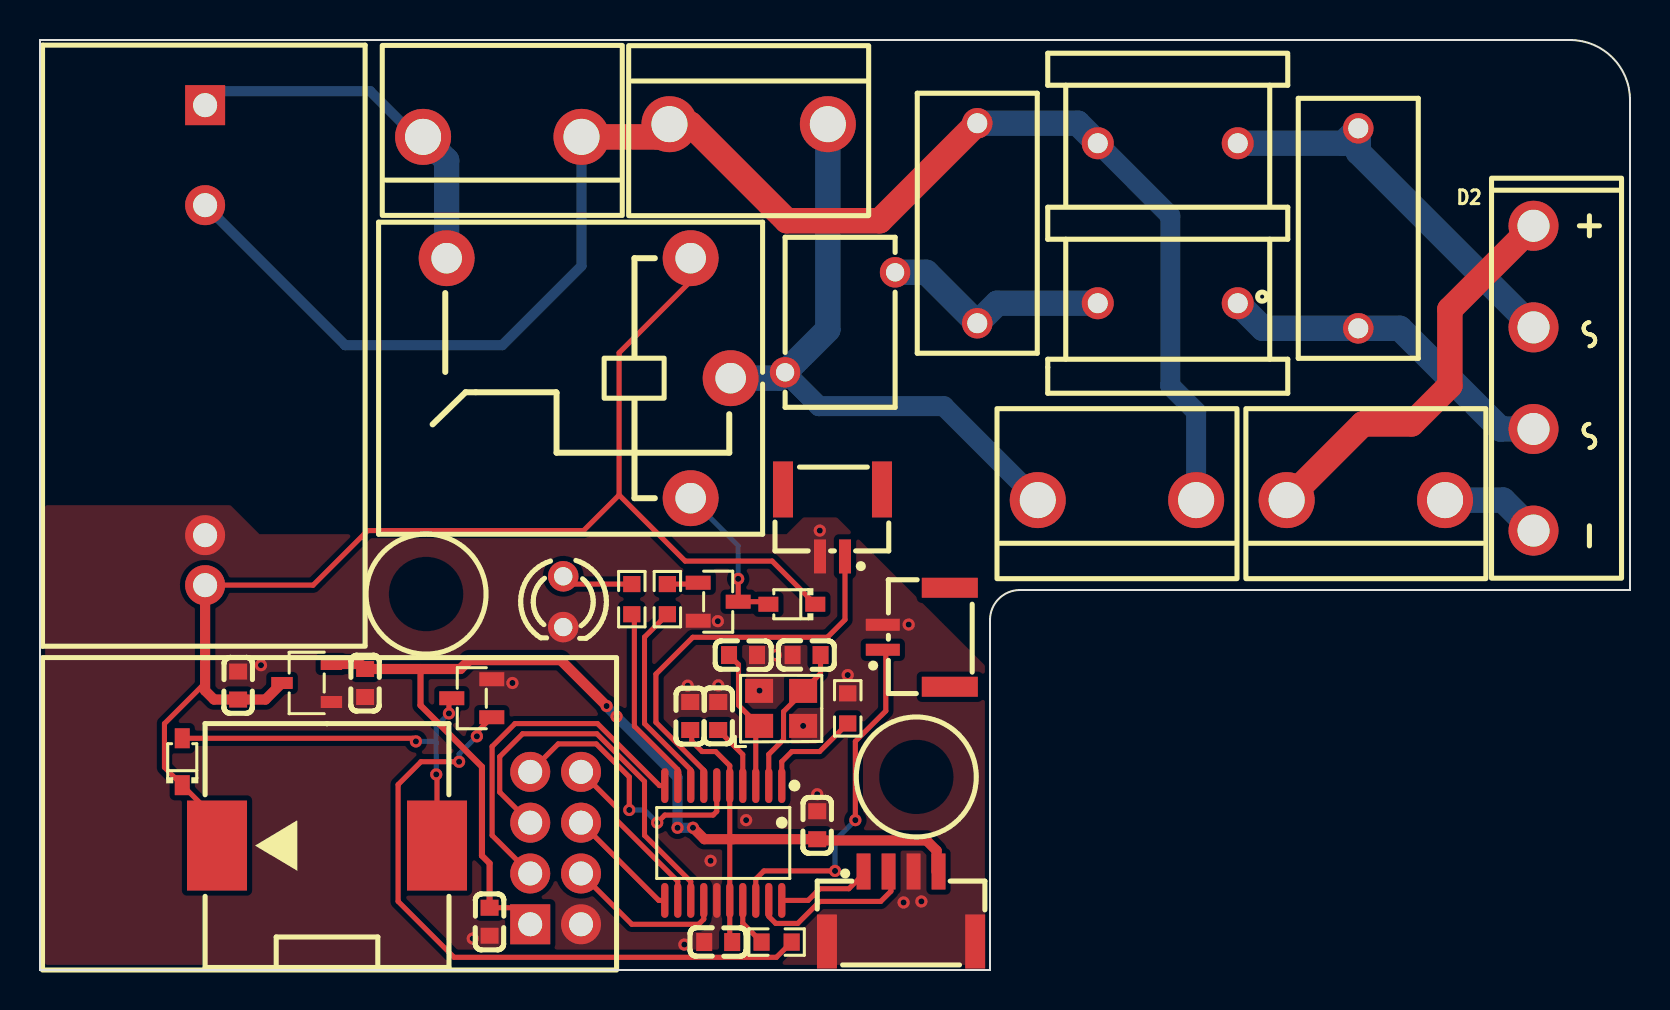
[diagram p2: board, top side]
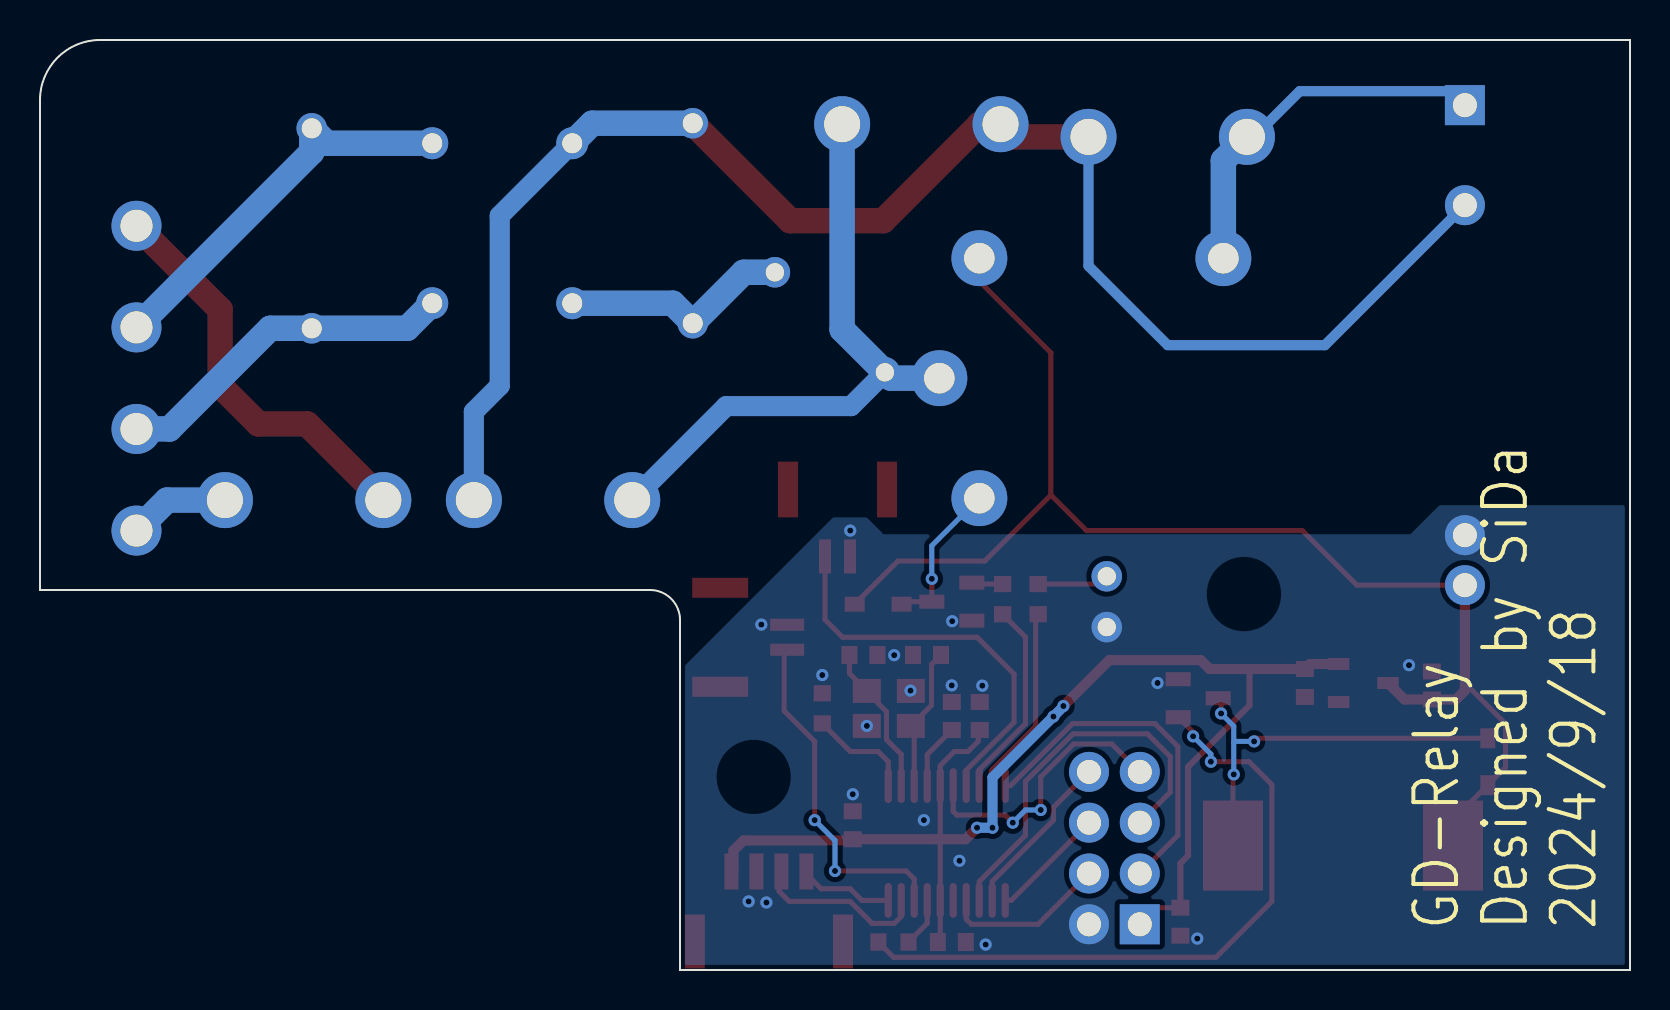
[diagram p3: board, bottom side, seen from below]

Outline 79.5 x 46.5 mm; copper layers: Top Layer, Bottom Layer. Coordinates in mm from the lower left corner of the outline.
Outline path: 0,46.5 76.5,46.5 arc(78.62,45.62) 79.5,43.5 79.5,19 49,19 arc(47.94,18.56) 47.5,17.5 47.5,0 0,0 0,46.5
Stack: Top Layer 0.035mm / Dielectric1 1.51mm FR4 er 4.5 / Bottom Layer 0.035mm

## Design rules (mm)
template: 自定义配置
spacing copperThickness1oz (default): track to track 0.127, other pairs 0.152 to 0.3
spacing copperThickness2oz: track to track 0.203, other pairs 0.152 to 0.3
track width copperThickness1oz (default): min 0.127, default 0.254, max 2.54
track width copperThickness2oz: min 0.203, default 0.254, max 2.54
differential pair differentialPair (default): width min 0.127, default 0.254, max 2.54; gap min 0.152, default 0.152
via viaSize (default): diameter min 0.5, default 0.61, max 10; hole min 0.3, default 0.305, max 6.299

## Placement (name value [footprint] x y rotation side)
BUZZER4  2kHz  [BUZ-SMD_2P-L12.0-W12.0-L]  14.35 6.22 0 top
C1  100nF  [CAP-TH_L13.0-W6.0-P10.0-D0.6]  46.86 37.34 270 top
C2  100nF  [CAP-TH_L13.0-W6.0-P10.0-D0.6]  65.91 37.08 270 top
C3  100nF  [C0603]  33.91 12.7 270 top
C4  100nF  [C0603]  35.15 15.75 180 top
C5  100nF  [C0603]  38.33 15.75 0 top
C7  100nF  [C0603]  9.91 14.22 270 top
C8  100nF  [C0603]  16.26 14.35 90 top
C9  100nF  [C0603]  32.51 12.7 90 top
C10  100nF  [C0603]  22.48 2.41 90 top
C11  100nF  [C0603]  38.86 7.24 90 top
C12  100nF  [C0603]  33.91 1.4 0 top
CN1  WAFER-GH1.25-2PLB  [CONN-TH_2P-P1.25_XUNPU_WAFER-GH1.25-2PLB]  39.62 22.35 180 top
CN2  WAFER-GH1.25-2PLB  [CONN-TH_2P-P1.25_XUNPU_WAFER-GH1.25-2PLB]  43.82 16.64 90 top
CN3  SWD  [CONN-SMD_4P-P1.27_GH125-S04DCA-00]  43.05 3.17 0 top
D2  KBL608  [DIO-BG-TH_KBL608]  74.68 29.59 0 top
D3  1N4148WS  [SOD-323_L1.8-W1.3-LS2.5-RD]  37.59 18.29 180 top
D4  1N4148WS  [SOD-323_L1.8-W1.3-LS2.5-RD]  7.11 10.41 90 top
K1  SRD-05VDC-SL-A  [RELAY-TH_SRD-DCXXV-SL-A]  27.43 29.59 180 top
L1  UU9.8-10mH  [FILTER-TH_4P-L17.0-W12.0-P7.00-D0.6-S8.00]  56.39 37.34 0 top
LED2  HL-304S9AD  [LED-TH_BD3.0-P2.54-FD]  26.16 18.41 270 top
Q9  SS8050  [SOT-23-3_L2.9-W1.3-P1.90-LS2.4-BR]  33.91 18.41 180 top
Q10  SS8050  [SOT-23-3_L2.9-W1.3-P1.90-LS2.4-BR]  21.59 13.59 0 top
R1  NTC 5D-7  [RES-TH_L8.5-W5.5-P5.00-D0.6-S5.50]  40.01 32.38 90 top
R2  10K  [R0603]  36.83 1.4 0 top
R3  10K  [R0603]  40.39 13.08 90 top
R4  10K  [R0603]  29.59 18.54 270 top
R5  10K  [R0603]  31.37 18.54 90 top
U1  GD32E230F4P6TR  [TSSOP-20_L6.5-W4.4-P0.65-LS6.4-BL]  34.16 6.35 180 top
U2  HLK-2M05  [PWRM-TH_HLK-2M05]  8.26 31.24 270 top
U3  2.4GHz  [WIRELM-TH_NF-01-S]  25.78 6.1 90 top
U5  ME6210A50M3G  [SOT-23-3_L2.9-W1.6-P1.90-LS2.8-BR]  13.34 14.35 0 top
U6  DC_IN  [CONN-TH_VH3.96-3A2]  66.29 23.49 180 top
U7  AC_IN  [CONN-TH_VH3.96-3A2]  23.11 41.66 180 top
U8  AC_OUT  [CONN-TH_VH3.96-3A2]  35.43 42.29 0 top
U9  LED2  [CONN-TH_VH3.96-3A2]  53.85 23.49 180 top
X1  8MHz  [OSC-SMD_4P-L3.2-W2.5-BL]  37.06 13.08 0 top

## Footprints (pads in the part's own frame, mm; a bottom-side part is the same pattern mirrored in y, then rotated)
BUZ-SMD_2P-L12.0-W12.0-L
  rect 3x4.5 smd: 1(-5.5,0) 2(5.5,0)
C0603
  rect 0.8x0.9 smd: 1(-0.7,0) 2(0.7,0)
CAP-TH_L13.0-W6.0-P10.0-D0.6
  round 1.524 hole 1: 1(-5,0) 2(5,0)
CONN-SMD_4P-P1.27_GH125-S04DCA-00
  rect 0.7x1.8 smd: 1(-1.875,1.75) 2(-0.625,1.75) 3(0.625,1.75) 4(1.875,1.75)
  rect 1x2.7 smd: 5(3.705,-1.75) 6(-3.705,-1.75)
CONN-TH_2P-P1.25_XUNPU_WAFER-GH1.25-2PLB
  rect 0.6x1.7 smd: 1(-0.625,1.675) 2(0.625,1.675)
  rect 1x2.8 smd: 3(2.475,-1.675) 4(-2.475,-1.675)
CONN-TH_VH3.96-3A2
  round 2.8 hole 1.8: 1(-3.96,0) 2(3.96,0)
DIO-BG-TH_KBL608
  round 2.5 hole 1.6: 1(0,2.54) 2(0,7.62) 3(0,-2.54) 4(0,-7.62)
FILTER-TH_4P-L17.0-W12.0-P7.00-D0.6-S8.00
  round 1.6 hole 1: 1(3.5,-4) 2(-3.5,-4) 3(-3.5,4) 4(3.5,4)
LED-TH_BD3.0-P2.54-FD
  round 1.524 hole 0.914: 1(-1.27,0) 2(1.27,0)
OSC-SMD_4P-L3.2-W2.5-BL
  rect 1.4x1.2 smd: 1(-1.1,-0.875) 2(1.1,-0.875) 3(1.1,0.875) 4(-1.1,0.875)
PWRM-TH_HLK-2M05
  rect 2x2 hole 1.2: 1(-12,0)
  round 2 hole 1.2: 2(-7,0) 3(9.5,0) 4(12,0)
R0603
  rect 0.806x0.864 smd: 1(-0.753,0) 2(0.753,0)
RELAY-TH_SRD-DCXXV-SL-A
  round 2.794 hole 1.524: 1(-5.1,-6) 2(7.1,-6) 4(-5.1,6) 5(-7.1,0)
RES-TH_L8.5-W5.5-P5.00-D0.6-S5.50
  round 1.524 hole 0.914: 1(-2.5,2.75) 2(2.5,-2.75)
SOD-323_L1.8-W1.3-LS2.5-RD
  rect 1x0.75 smd: 1(-1.173,0) 2(1.173,0)
SOT-23-3_L2.9-W1.3-P1.90-LS2.4-BR
  rect 1.25x0.7 smd: 1(1,-0.95) 2(1,0.95) 3(-1,0)
SOT-23-3_L2.9-W1.6-P1.90-LS2.8-BR
  rect 1.07x0.6 smd: 1(1.235,-0.95) 2(1.235,0.95) 3(-1.235,0)
TSSOP-20_L6.5-W4.4-P0.65-LS6.4-BL
  oval 0.364x1.742 smd: 1(-2.925,-2.871) 2(-2.275,-2.871) 3(-1.625,-2.871) 4(-0.975,-2.871) 5(-0.325,-2.871) 6(0.325,-2.871) 7(0.975,-2.871) 8(1.625,-2.871) 9(2.275,-2.871) 10(2.925,-2.871) 11(2.925,2.871) 12(2.275,2.871) 13(1.625,2.871) 14(0.975,2.871) 15(0.325,2.871) 16(-0.325,2.871) 17(-0.975,2.871) 18(-1.625,2.871) 19(-2.275,2.871) 20(-2.925,2.871)
WIRELM-TH_NF-01-S
  rect 2x2 hole 1.2: 1(-3.81,1.27)
  round 2 hole 1.2: 2(-3.81,-1.27) 3(-1.27,1.27) 4(-1.27,-1.27) 5(1.27,1.27) 6(1.27,-1.27) 7(3.81,1.27) 8(3.81,-1.27)

## Nets
As in the schematic.

Pads without a net: CN1 3 4; CN2 3 4

## Via types
v1: diameter 0.61, hole 0.305, Top Layer to Bottom Layer, 32 vias

## Routing (per net, layer and track width the routed paths; a pad name or vN(x,y) marks a point on that pad's centre or on a via; arc(x,y) is an arc through that point)
+3.3V: length 64.9
  Top Layer w0.254: U3.1 23.68,3.11 C10.2 ; C12.2 34.49,1.52 34.49,6.36 34.67,6.54 34.49,6.72 34.49,10.22 33.78,10.92 33.1,10.92 32.59,11.44 32.59,11.8 32.39,12
  Top Layer w0.305: 19.03,15.05 19.03,13.23 22.1,10.16 22.1,5.71 22.48,5.33 C10.2
  Top Layer w0.508: CN3.4 44.83,4.92 44.83,5.97 44.32,6.48 38.92,6.48 38.86,6.54 33.22,6.54 v1(32.65,7.11) ; U5.2 16.01,15.3 C8.2 21.02,15.05 21.46,15.49 26.04,15.49 v1(28.33,13.2)
  Bottom Layer w0.508: v1(28.33,13.2) 28.33,13.17 v1(28.83,12.67) 31.88,9.62 v1(31.88,7.11) v1(32.65,7.11)
+5V: length 67.7
  Top Layer w0.254: 8.26,13.97 8.06,14.16 6.22,12.32 6.22,10.13 D4.1 8.85,7.5 BUZZER4.1 ; 28.96,23.75 28.96,30.86 32.53,34.44 K1.1 ; 28.96,23.75 32.26,20.45 36.61,20.45 D3.1 ; 28.96,23.75 27.18,21.97 16.38,21.97 13.65,19.24 U2.4
  Top Layer w0.508: U5.3 11.27,13.52 C7.2 8.7,13.52 8.26,13.97 U2.4
GND:
  vias: v1(11.05,15.24) v1(21.64,1.57) v1(23.62,14.35) v1(32.22,1.27) v1(32.39,14.22) v1(33.53,5.46) v1(33.89,17.44) v1(33.91,14.23) v1(35.31,7.49) v1(35.98,13.97) v1(36.79,15.74) v1(38.16,12.2) v1(38.86,8.79) v1(38.99,21.97) v1(40.39,14.75) v1(43.18,3.38) v1(43.43,17.27) v1(44.07,3.43)
BUZZER: length 2.5
  Top Layer w0.254: U1.17 35.14,2.34 R2.1
KEY1: length 20.3
  Top Layer w0.254: CN1.1 40.25,17.52 39.37,16.64 32.64,16.64 30.8,14.8 30.8,12.38 33.19,9.99 U1.7
KEY2: length 17.4
  Top Layer w0.254: CN2.1 42.29,15.86 42.29,12.95 40.77,11.43 v1(40.77,7.49) ; v1(39.75,4.95) 36.2,4.95 35.79,4.55 U1.18
  Bottom Layer w0.254: v1(40.77,7.49) 39.75,6.48 v1(39.75,4.95)
LED1: length 9.5
  Top Layer w0.254: U1.9 31.89,10.02 29.72,12.19 29.72,17.66 R4.2
RELAY: length 7.7
  Top Layer w0.254: v1(34.91,19.56) Q9.3 36.29,18.41 D3.2
  Bottom Layer w0.254: v1(34.91,19.56) 34.91,21.21 K1.4
RELAY_ON_H: length 10
  Top Layer w0.254: U1.8 32.54,10.01 30.23,12.32 30.23,16.65 R5.1
SI24_CE: length 8.2
  Top Layer w0.254: U1.14 33.19,2.54 32.93,2.29 29.59,2.29 U3.4
SI24_IRQ: length 14
  Top Layer w0.254: U3.7 25.91,11.3 27.81,11.3 29.46,9.65 v1(29.46,8) ; U1.6 33.84,7.93 33.66,7.75 31.24,7.75 v1(30.86,7.37)
  Bottom Layer w0.254: v1(29.46,8) 30.23,8 v1(30.86,7.37)
SPI0_MISO: length 8.4
  Top Layer w0.254: U1.12 31.89,4.43 28.83,7.49 28.83,8.13 U3.8
SPI0_MOSI: length 19.5
  Top Layer w0.254: U1.13 32.54,4.42 30.23,6.73 30.23,9.43 27.84,11.81 24.13,11.81 22.99,10.67 22.99,8.89 U3.5
SPI0_NSS: length 17.5
  Top Layer w0.254: U3.3 22.61,6.73 22.61,11.18 23.75,12.32 27.87,12.32 30.97,9.22 U1.10
SPI0_SCK: length 5.8
  Top Layer w0.254: U3.6 30.94,3.48 U1.11
SWCLK: length 4.8
  Top Layer w0.254: U1.20 38.4,3.48 38.99,4.06 40.44,4.06 41.3,4.92
SWDIO: length 9.5
  Top Layer w0.254: 42.42,5.68 42.55,5.55 42.55,3.94 42.04,3.43 38.99,3.43 37.89,2.33 36.79,2.33 36.45,2.67 36.45,3.47 U1.19
$1N1219: length 11.6
  Bottom Layer w1.27: R1.2 44.32,34.88 C1.2 47.86,33.34 L1.2
$1N1562: length 19.9
  Bottom Layer w1.27: L1.4 65.17,41.34 C2.1 65.91,40.89 D2.1
$1N1568: length 17.4
  Bottom Layer w1.27: L1.1 61.14,32.08 C2.2 67.99,32.08 73.02,27.05 74.68,27.05
$1N1587: length 80.2
  Top Layer w1.27: C1.1 41.99,37.46 37.34,37.46 32.51,42.29 U8.1 30.84,41.66 U7.1
  Bottom Layer w0.508: U7.1 27.07,35.2 23.11,31.24 15.26,31.24 U2.2
  Bottom Layer w1.001: L1.3 56.52,37.71 56.52,29.21 57.81,27.92 U9.1
  Bottom Layer w1.27: C1.1 51.89,42.34 L1.3
$1N1625: length 31.4
  Bottom Layer w1.001: U9.2 45.19,28.19 38.95,28.19 R1.1
  Bottom Layer w1.27: U8.2 39.39,32.02 R1.1 36.96,29.59 K1.5
$1N1813: length 20.3
  Top Layer w1.27: D2.2 70.49,33.03 70.49,29.22 68.58,27.3 66.14,27.3 U6.2
$1N1820: length 5.1
  Bottom Layer w1.27: D2.4 73.15,23.49 U6.1
$1N2210: length 3.3
  Top Layer w0.254: C3.2 35.14,10.77 U1.4
$1N2387: length 7.2
  Top Layer w0.254: C4.2 34.92,15.27 34.92,13.24 X1.1 35.79,12.04 U1.3
$1N2393: length 7.6
  Top Layer w0.254: C5.2 39.03,14.82 X1.3 38.16,13.9 37.18,12.92 37.18,11.52 36.44,10.78 U1.2
$1N2535: length 5.3
  Top Layer w0.254: R3.1 38.98,10.92 37.59,10.92 37.09,10.42 U1.1
$1N3342: length 1.6
  Top Layer w0.254: Q9.1 32.84,19.3 R5.2
$1N5543: length 3.6
  Top Layer w0.254: R4.1 26.55,19.3 LED2.1
$1N5747: length 33.4
  Top Layer w0.254: Q10.1 21.84,11.89 v1(21.84,11.68) ; R2.2 36.82,0.63 20.7,0.63 17.91,3.43 17.91,9.27 19.05,10.41 v1(20.95,10.41)
  Bottom Layer w0.254: v1(21.84,11.68) 20.95,10.8 v1(20.95,10.41)
$1N6773: length 20.5
  Top Layer w0.254: Q10.3 20.45,13.45 v1(20.45,12.83) ; BUZZER4.2 19.85,9.74 v1(19.81,9.78) ; D4.2 18.64,11.59 v1(18.8,11.43)
  Bottom Layer w0.254: v1(20.45,12.83) 19.81,12.19 19.81,11.35 ; 19.81,11.35 19.74,11.43 v1(18.8,11.43) ; 19.81,11.35 v1(19.81,9.78)
$1N7266: length 18.7
  Bottom Layer w0.508: U7.2 18.8,41.66 16.51,43.94 8.95,43.94 U2.1
  Bottom Layer w1.27: K1.2 20.33,40.48 U7.2

## Copper pours and planes (outline as drawn; the poured copper is in the pictures)
GND on Top Layer: 47.5,0 47.5,14.97 39.85,22.63 38.16,22.63 37.33,21.79 10.98,21.79 9.53,23.24 0.29,23.24 0,22.95 0,0
GND on Bottom Layer: 47.5,0 47.5,14.97 39.85,22.63 38.16,22.63 37.33,21.79 10.98,21.79 9.53,23.24 0.29,23.24 0,22.95 0,0

## Text on the board
Bottom Silkscreen Layer: GD-Relay / Designed by SiDa / 2024/9/18

# Board PCB2
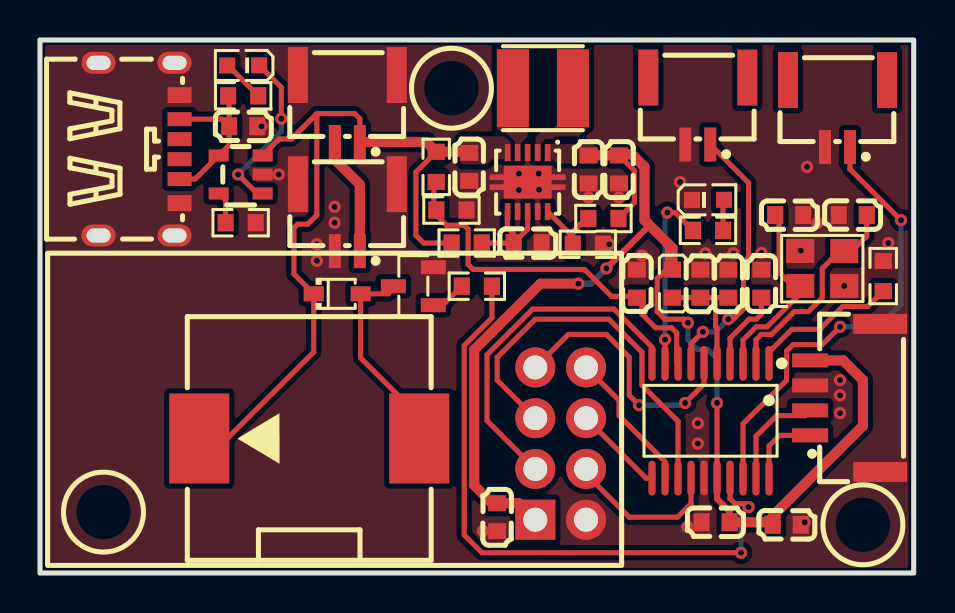
[diagram p4: board, top side]
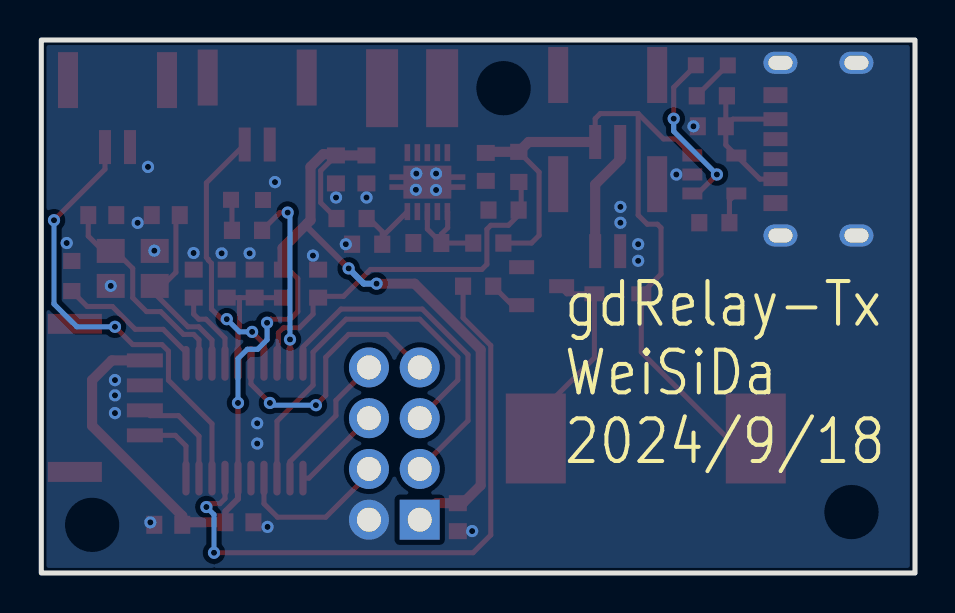
[diagram p5: board, bottom side, seen from below]

Outline 43.69 x 26.67 mm; copper layers: Top Layer, Bottom Layer. Coordinates in mm from the lower left corner of the outline.
Outline path: rectangle 0,26.67 43.69,0
Stack: Top Layer 0.035mm / Dielectric1 1.51mm FR4 er 4.5 / Bottom Layer 0.035mm

## Design rules (mm)
template: 自定义配置
spacing copperThickness1oz (default): track to track 0.127, other pairs 0.152 to 0.3
spacing copperThickness2oz: track to track 0.203, other pairs 0.152 to 0.3
track width copperThickness1oz (default): min 0.127, default 0.254, max 2.54
track width copperThickness2oz: min 0.203, default 0.254, max 2.54
differential pair differentialPair (default): width min 0.127, default 0.254, max 2.54; gap min 0.152, default 0.152
via viaSize (default): diameter min 0.5, default 0.61, max 10; hole min 0.3, default 0.305, max 6.299

## Placement (name value [footprint] x y rotation side)
BUZZER4  2kHz  [BUZ-SMD_2P-L12.0-W12.0-L]  13.46 6.73 0 top
C3  100nF  [C0603]  36.07 14.48 270 top
C4  100nF  [C0603]  37.47 17.91 180 top
C5  100nF  [C0603]  40.64 17.91 0 top
C9  100nF  [C0603]  33.02 14.48 90 top
C10  100nF  [C0603]  22.86 2.79 90 top
C11  100nF  [C0603]  34.42 14.48 90 top
C12  100nF  [C0603]  33.78 2.54 0 top
C14  10uF  [C0603]  27.43 20.19 90 top
C15  10uF  [C0603]  28.96 20.19 90 top
C20  10uF  [C0603]  21.46 20.32 90 top
C24  1uF  [C0603]  29.84 14.48 270 top
C25  100nF  [C0603]  24.38 16.51 180 top
C26  100nF  [C0603]  10.16 22.35 180 top
C27  100nF  [C0603]  37.34 2.41 180 top
CN1  WAFER-GH1.25-2PLB  [CONN-TH_2P-P1.25_XUNPU_WAFER-GH1.25-2PLB]  32.89 23.11 180 top
CN2  WAFER-GH1.25-2PLB  [CONN-TH_2P-P1.25_XUNPU_WAFER-GH1.25-2PLB]  39.88 22.99 180 top
CN3  SWD  [CONN-SMD_4P-P1.27_GH125-S04DCA-00]  40.26 8.76 90 top
CN5  SW1  [CONN-TH_2P-P1.25_XUNPU_WAFER-GH1.25-2PLB]  15.37 23.24 180 top
CN6  BT  [CONN-TH_2P-P1.25_XUNPU_WAFER-GH1.25-2PLB]  15.37 17.78 180 top
D4  1N4148WS  [SOD-323_L1.8-W1.3-LS2.5-RD]  14.86 13.97 0 top
L1  2.2uH  [IND-SMD_L4.0-W4.0_FNR40XXS]  25.15 24.26 0 top
L2  10uH  [L0603]  31.62 14.48 270 top
LED3  XL-1608UGC-04  [LED0603-RD_GREEN]  10.16 25.4 180 top
LED4  XL-1608UGC-04  [LED0603-RD_GREEN]  33.4 18.67 0 top
Q10  SS8050  [SOT-23-3_L2.9-W1.3-P1.90-LS2.4-BR]  18.67 14.35 0 top
R2  10K  [R0603]  21.84 14.35 180 top
R3  10K  [R0603]  42.16 14.86 90 top
R4  10K  [R0603]  33.4 17.14 180 top
R9  10k  [R0603]  28.17 17.74 0 top
R10  10k  [R0603]  27.39 16.45 180 top
R11  200K  [R0603]  19.81 20.32 90 top
R12  200K  [R0603]  20.57 18.16 180 top
R13  10k  [R0603]  21.34 16.51 180 top
R14  10K  [R0603]  10.03 17.53 180 top
R15  10K  [R0603]  10.16 23.88 180 top
U1  GD32E230F4P6TR  [TSSOP-20_L6.5-W4.4-P0.65-LS6.4-BL]  33.53 7.62 180 top
U3  2.4GHz  [WIRELM-TH_NF-01-S]  26.03 6.48 90 top
U10  TPS63000DRCR  [SON-10_L3.1-W3.1-P0.50-TL-EP]  24.38 19.56 270 top
U11  ME4075AM5G  [SOT-23-5_L2.9-W1.6-P0.95-LS2.8-BL]  10.03 19.94 90 top
USB1  TYPE-C 6P(073)  [TYPE-C-SMD_TYPE-C-6P_5]  4.95 21.21 270 top
X1  8MHz  [OSC-SMD_4P-L3.2-W2.5-BL]  39.12 15.24 0 top

## Footprints (pads in the part's own frame, mm; a bottom-side part is the same pattern mirrored in y, then rotated)
BUZ-SMD_2P-L12.0-W12.0-L
  rect 3x4.5 smd: 1(-5.5,0) 2(5.5,0)
C0603
  rect 0.8x0.9 smd: 1(-0.7,0) 2(0.7,0)
CONN-SMD_4P-P1.27_GH125-S04DCA-00
  rect 0.7x1.8 smd: 1(-1.875,1.75) 2(-0.625,1.75) 3(0.625,1.75) 4(1.875,1.75)
  rect 1x2.7 smd: 5(3.705,-1.75) 6(-3.705,-1.75)
CONN-TH_2P-P1.25_XUNPU_WAFER-GH1.25-2PLB
  rect 0.6x1.7 smd: 1(-0.625,1.675) 2(0.625,1.675)
  rect 1x2.8 smd: 3(2.475,-1.675) 4(-2.475,-1.675)
IND-SMD_L4.0-W4.0_FNR40XXS
  rect 1.6x3.899 smd: 1(-1.501,0) 2(1.501,0)
L0603
  rect 0.8x0.864 smd: 1(-0.7,0) 2(0.7,0)
LED0603-RD_GREEN
  rect 0.8x0.8 smd: 1(-0.799,-0.004) 2(0.799,0.004)
OSC-SMD_4P-L3.2-W2.5-BL
  rect 1.4x1.2 smd: 1(-1.1,-0.875) 2(1.1,-0.875) 3(1.1,0.875) 4(-1.1,0.875)
R0603
  rect 0.806x0.864 smd: 1(-0.753,0) 2(0.753,0)
SOD-323_L1.8-W1.3-LS2.5-RD
  rect 1x0.75 smd: 1(-1.173,0) 2(1.173,0)
SON-10_L3.1-W3.1-P0.50-TL-EP
  rect 0.85x0.28 smd: 1(-1.475,1) 2(-1.475,0.5) 3(-1.475,0) 4(-1.475,-0.5) 5(-1.475,-1) 6(1.475,-1) 7(1.475,-0.5) 8(1.475,0) 9(1.475,0.5) 10(1.475,1)
  custom 1.651x3.8 smd: 11(0,0)
SOT-23-3_L2.9-W1.3-P1.90-LS2.4-BR
  rect 1.25x0.7 smd: 1(1,-0.95) 2(1,0.95) 3(-1,0)
SOT-23-5_L2.9-W1.6-P0.95-LS2.8-BL
  rect 0.6x1 smd: 1(-0.95,-1.1) 2(0,-1.1) 3(0.95,-1.1) 4(0.95,1.1) 5(-0.95,1.1)
TSSOP-20_L6.5-W4.4-P0.65-LS6.4-BL
  oval 0.364x1.742 smd: 1(-2.925,-2.871) 2(-2.275,-2.871) 3(-1.625,-2.871) 4(-0.975,-2.871) 5(-0.325,-2.871) 6(0.325,-2.871) 7(0.975,-2.871) 8(1.625,-2.871) 9(2.275,-2.871) 10(2.925,-2.871) 11(2.925,2.871) 12(2.275,2.871) 13(1.625,2.871) 14(0.975,2.871) 15(0.325,2.871) 16(-0.325,2.871) 17(-0.975,2.871) 18(-1.625,2.871) 19(-2.275,2.871) 20(-2.925,2.871)
TYPE-C-SMD_TYPE-C-6P_5
  oval 1.1x1.7 hole 0.7x1.2: 7(-4.32,1.775) 7(-4.32,-2.025) 7(4.32,1.775) 7(4.32,-2.025)
  rect 0.7x1.2 smd: A5(-0.5,2.025) A9(1.5,2.025) B5(0.5,2.025) B9(-1.5,2.025)
  rect 0.8x1.2 smd: A12(2.7,2.025) B12(-2.7,2.025)
WIRELM-TH_NF-01-S
  rect 2x2 hole 1.2: 1(-3.81,1.27)
  round 2 hole 1.2: 2(-3.81,-1.27) 3(-1.27,1.27) 4(-1.27,-1.27) 5(1.27,1.27) 6(1.27,-1.27) 7(3.81,1.27) 8(3.81,-1.27)

## Nets
As in the schematic.

Pads without a net: CN1 3 4; CN2 3 4; USB1 A5 B5

## Via types
v1: diameter 0.61, hole 0.305, Top Layer to Bottom Layer, 47 vias

## Routing (per net, layer and track width the routed paths; a pad name or vN(x,y) marks a point on that pad's centre or on a via; arc(x,y) is an arc through that point)
+3.3V: length 65.5
  Top Layer w0.254: 31.38,16.5 31.38,15.25 30.86,14.73 30.86,13.08 31.24,12.7 32.22,12.7 v1(32.4,12.52) ; C15.2 29.72,20.13 29.72,18.53 28.93,17.74 ; U1.16 v1(33.85,8.51)
  Top Layer w0.305: v1(28.32,15.24) 30.4,17.32 30.4,17.48 ; U1.16 33.85,3.71 34.48,3.08 C12.2
  Top Layer w0.5: 22.61,3.49 21.72,4.38 21.72,11.18 25.02,14.48 v1(26.92,14.48)
  Top Layer w0.508: C12.2 36.51,2.54 C27.2 36.64,2.86 41.15,7.37 41.15,9.65 40.16,10.64 CN3.4 ; U3.1 23.94,3.49 22.61,3.49 ; L2.1 31.62,16.26 30.23,17.65 30.23,20.32 29.59,20.95 29.02,20.95 C15.2 C14.2
  Bottom Layer w0.254: v1(33.85,8.51) 33.85,10.72 33.38,11.19 32.87,11.19 32.4,11.67 v1(32.4,12.52)
  Bottom Layer w0.305: v1(28.32,15.24) 27.56,14.48 v1(26.92,14.48)
GND:
  vias: v1(11.08,22.35) v1(11.94,19.94) v1(13.84,16.45) v1(13.84,15.62) v1(14.73,18.32) v1(14.73,17.53) v1(22.14,2.1) v1(23.95,19.98) v1(23.95,19.16) v1(24.94,19.98) v1(24.96,19.18) v1(27.43,18.79) v1(28.46,16.45) v1(28.95,18.79) v1(30.1,15.88) v1(32,19.56) v1(32.38,2.31) v1(32.89,7.49) v1(32.89,6.48) v1(33.27,15.99) v1(34.67,15.99) v1(36.07,16.01) v1(38.04,16.13) v1(38.24,2.53) v1(38.35,20.32) v1(38.87,17.52) v1(40,9.65) v1(40,8.89) v1(40,8) v1(40.22,14.36) v1(42.42,16.51)
ADC1: length 19.2
  Top Layer w0.254: 30.03,13.84 28.58,13.84 27.23,15.19 21.66,15.19 21.41,15.44 21.41,17.2 21.21,17.4 20.33,17.4 19.69,18.03 19.69,19.45 R11.1 ; 30.1,13.78 30.1,12.95 30.78,12.27 31.58,12.27 31.84,12.01 31.84,10.56 U1.8
BT+: length 38.8
  Top Layer w0.254: 13.84,22.99 12.57,21.72 11.96,21.72 U11.3 ; 13.84,22.99 13.84,17.91 13.39,17.45 12.88,17.45 12.7,17.27 12.7,14.96 D4.1 13.69,11.06 9.11,6.48 ; 13.84,22.99 15.74,22.99 15.99,22.73 CN5.1 ; R13.2 19.18,16.51 18.8,16.89 18.8,20.06 R11.2
  Top Layer w0.508: CN5.1 19.32,21.57 R11.2 21.41,21.07 C20.2
BUZZER: length 31.8
  Top Layer w0.254: v1(35.43,3.3) 35.27,3.47 34.76,3.47 34.5,3.72 U1.17 ; R2.1 22.6,12.77 21.21,11.38 21.21,1.9 22.1,1.02 v1(35.05,1.02)
  Bottom Layer w0.254: v1(35.43,3.3) 35.05,2.92 v1(35.05,1.02)
KEY1: length 13.5
  Top Layer w0.254: CN1.1 35.43,19.52 35.43,15.79 35.34,15.69 35.34,15.65 35.18,15.49 35.18,13.21 34.67,12.7 v1(34.41,12.7) ; v1(33.15,12.06) 32.55,11.47 32.55,10.49
  Bottom Layer w0.254: v1(33.15,12.06) 33.78,12.06 v1(34.41,12.7)
KEY2: length 22.9
  Top Layer w0.254: v1(40,12.32) 39.12,11.43 37.66,11.43 37.33,11.1 37.33,9.64 35.15,7.47 U1.18 ; v1(43.05,17.65) 40.5,20.2 CN2.1
  Bottom Layer w0.254: v1(43.05,17.65) 43.05,13.46 41.91,12.32 v1(40,12.32)
LED1: length 9.2
  Top Layer w0.254: v1(31.37,18.03) 31.76,18.03 R4.2 ; U1.9 v1(31.25,11.68)
  Bottom Layer w0.254: v1(31.37,18.03) 31.25,17.92 v1(31.25,11.68)
SI24_CE: length 8
  Top Layer w0.254: U3.4 27.31,4.95 29.46,2.79 31.88,2.79 32.55,3.47 32.55,4.75
SI24_IRQ: length 13.2
  Top Layer w0.254: U3.7 26.42,11.94 28.32,11.94 29.46,10.8 29.46,8.89 v1(29.96,8.4) ; v1(32.26,8.51) 33.2,9.45 U1.6
  Bottom Layer w0.254: v1(32.26,8.51) 32.15,8.4 v1(29.96,8.4)
SPI0_MISO: length 7.2
  Top Layer w0.254: U3.8 28.96,8.64 28.96,7.87 31.25,5.58 U1.12
SPI0_MOSI: length 19.6
  Top Layer w0.254: U1.13 31.9,7.59 30.1,9.4 30.1,11.05 28.45,12.7 24.77,12.7 22.86,10.8 22.86,9.65 U3.5
SPI0_NSS: length 17.5
  Top Layer w0.254: U1.10 30.61,10.49 30.61,11.3 28.7,13.21 24.64,13.21 22.35,10.92 22.35,7.62 U3.3
SPI0_SCK: length 4.5
  Top Layer w0.254: U1.11 30.3,4.75 U3.6
SWCLK: length 3.9
  Top Layer w0.254: CN3.1 36.99,6.89 36.45,6.35 36.45,4.75
SWDIO: length 5.3
  Top Layer w0.254: U1.19 35.8,6.85 36.83,7.87 38.25,7.87 CN3.2
$1N1260: length 6.4
  Top Layer w0.254: U1.5 33.85,12.25 33.78,12.32 33.78,13.76 33.76,13.78 ; 33.76,13.78 34.67,13.78 ; 33.76,13.78 C9.1 L2.2
$1N1281: length 1.8
  Top Layer w0.254: R2.2 20.14,13.4 Q10.1
$1N1282: length 10.9
  Top Layer w0.254: 20.11,6.48 20.11,6.69 16.03,10.77 D4.2 17.42,13.97 17.67,14.22
$1N1323: length 10.4
  Top Layer w0.254: U1.2 35.8,11.67 36.07,11.94 36.58,11.94 37.72,13.08 38.43,13.08 39.12,13.77 39.12,15.24 39.61,15.73 40.22,15.73 41.34,16.86 41.34,17.53
$1N1324: length 9
  Top Layer w0.254: U1.3 35.15,11.66 35.81,12.32 36.35,12.32 38.02,13.98 36.96,15.04 36.96,17.5
$1N1340: length 4.1
  Top Layer w0.254: U1.4 34.5,11.75 35.46,12.7 35.81,12.7 36.07,12.95 C3.2
$1N1345: length 7.5
  Top Layer w0.254: 36.45,10.49 36.45,11.05 37.59,12.19 38.99,12.19 40.13,13.33 41.39,13.33 R3.1
$1N2057: length 3.5
  Top Layer w0.254: R10.2 26.64,16.83 ; 26.64,16.83 U10.10 ; 26.64,16.83 26.64,17.08 27.42,17.86
$1N2391: length 6
  Top Layer w0.508: CN6.1 15.99,19.44 14.73,20.7 14.73,21.56 CN5.2
$1N2971: length 5.2
  Top Layer w0.254: C25.2 23.68,16.96 23.37,17.27 23.37,18.07 U10.6 ; C25.2 24.38,17.21 U10.8 ; C25.2 R13.1
$1N3227: length 8.3
  Top Layer w0.254: USB1.B9 9.1,22.71 C26.2 ; USB1.A9 7.75,19.71 U11.4 9.46,21.42 C26.2 ; C26.2 9.46,23.82 R15.2
$1N4478: length 1.6
  Top Layer w0.254: R14.2 9.28,18.64 U11.5
$1N4641: length 2.2
  Top Layer w0.254: LED3.2 9.39,25.4 R15.1
$1N4706: length 8.4
  Top Layer w0.254: LED3.1 12.06,24.3 v1(12.06,22.73) ; U11.1 10.86,18.99 v1(9.91,19.94)
  Bottom Layer w0.254: v1(12.06,22.73) 12.06,22.1 v1(9.91,19.94)
$1N6003: length 1.5
  Top Layer w0.254: R4.1 34.15,18.63 LED4.2

## Copper pours and planes (outline as drawn; the poured copper is in the pictures)
+3.3V on Top Layer: 25.27,21.46 27.87,21.46 27.87,20.5 25.27,20.5
GND on Top Layer: 0,26.67 43.69,26.67 43.69,0 0,0
GND on Bottom Layer: 0,26.67 43.69,26.67 43.69,0 0,0
BT+ on Top Layer: 20.97,21.84 23.5,21.84 23.5,20.45 20.97,20.45
$1N2047 on Top Layer: 22.86,22.61 24.38,22.61 24.38,21.34 22.86,21.34
$1N2048 on Top Layer: 24.77,22.48 27.43,22.48 27.43,21.34 24.77,21.34

## Text on the board
Bottom Silkscreen Layer: gdRelay-Tx / WeiSiDa / 2024/9/18
